# Altium project RFSoC-AMC.PrjPCB (part 15 of 22)

## Sheet SoC_FPGA_HD_84_87.SchDoc: RFSoC AMC
size 420 x 297 mm; CompanyName: WUT; DrawnBy: T. Przywozki; Organization: WUT ISE; Address1: Warsaw University of Technology; Address2: Nowowiejska 15/19 00-665 Warsaw; Address3: Tomasz.Przywozki@pw.edu.pl; DocumentNumber: 5; Revision: 1; SheetNumber: 5; SheetTotal: 45; Project: RFSoC AMC; ModifiedBy: T. Przywozki; CreateDate: -; CheckedDate: -; DivGrp: ISE; Designer: T. Przywozki; ModifiedDate: -; ProjectName: ADC/DAC MEZZANINE
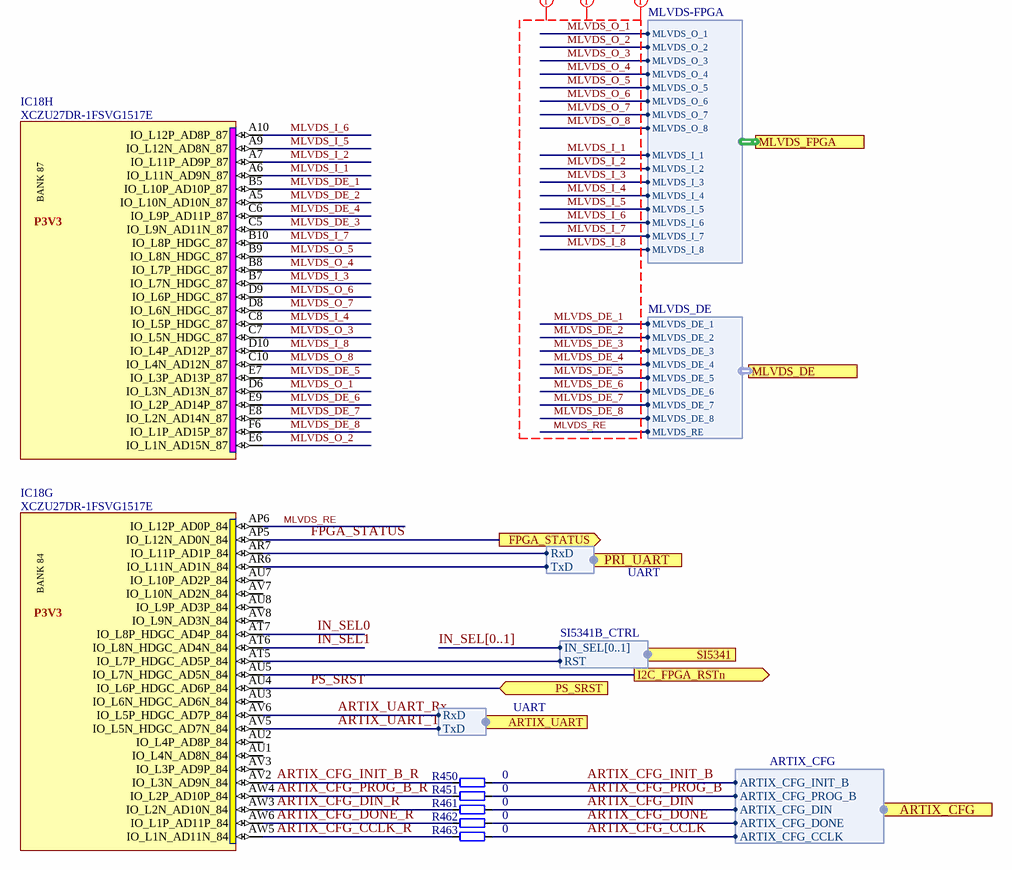
[diagram p30: SoC_FPGA_HD_84_87.SchDoc]

### Parts
IC18  XCZU27DR-1FSVG1517E  [XILINX_FSVG1517 (XCZU27DR)]  (parts G,H of 31)
R450  0  [RESC1005X40N]
R451  0  [RESC1005X40N]
R461  0  [RESC1005X40N]
R462  0  [RESC1005X40N]
R463  0  [RESC1005X40N]

### Ports
ARTIX_CFG (harness ARTIX_CFG), ARTIX_UART (harness UART), FPGA_STATUS (out), I2C_FPGA_RSTn (out), MLVDS_DE (harness MLVDS_DE), MLVDS_FPGA (harness MLVDS-FPGA), PRI_UART (harness UART), PS_SRST (in), SI5341 (harness SI5341B_CTRL)

### Harnesses
ARTIX_CFG: ARTIX_CFG_DIN, ARTIX_CFG_CCLK, ARTIX_CFG_PROG_B, ARTIX_CFG_DONE, ARTIX_CFG_INIT_B
UART: RxD, TxD
SI5341B_CTRL: IN_SEL[0..1], RST
MLVDS-FPGA: MLVDS_O_1, MLVDS_O_2, MLVDS_O_3, MLVDS_O_4, MLVDS_O_5, MLVDS_O_6, MLVDS_O_7, MLVDS_O_8, MLVDS_I_1, MLVDS_I_2, MLVDS_I_3, MLVDS_I_4, MLVDS_I_5, MLVDS_I_6, MLVDS_I_7, MLVDS_I_8
MLVDS_DE: MLVDS_DE_1, MLVDS_DE_2, MLVDS_DE_3, MLVDS_DE_4, MLVDS_DE_5, MLVDS_DE_6, MLVDS_DE_7, MLVDS_DE_8, MLVDS_RE

### Nets
ARTIX_CFG_CCLK: R463.2 ; port ARTIX_CFG.ARTIX_CFG_CCLK  [project net ARTIX_CFG.ARTIX_CFG_CCLK]
ARTIX_CFG_CCLK_R: IC18.AW5(IO_L1N_AD11N_84) R463.1
ARTIX_CFG_DIN: R461.2 ; port ARTIX_CFG.ARTIX_CFG_DIN  [project net ARTIX_CFG.ARTIX_CFG_DIN]
ARTIX_CFG_DIN_R: IC18.AW3(IO_L2N_AD10N_84) R461.1
ARTIX_CFG_DONE: R462.2 ; port ARTIX_CFG.ARTIX_CFG_DONE  [project net ARTIX_CFG.ARTIX_CFG_DONE]
ARTIX_CFG_DONE_R: IC18.AW6(IO_L1P_AD11P_84) R462.1
ARTIX_CFG_INIT_B: R450.2 ; port ARTIX_CFG.ARTIX_CFG_INIT_B  [project net ARTIX_CFG.ARTIX_CFG_INIT_B]
ARTIX_CFG_INIT_B_R: IC18.AV2(IO_L3N_AD9N_84) R450.1
ARTIX_CFG_PROG_B: R451.2 ; port ARTIX_CFG.ARTIX_CFG_PROG_B  [project net ARTIX_CFG.ARTIX_CFG_PROG_B]
ARTIX_CFG_PROG_B_R: IC18.AW4(IO_L2P_AD10P_84) R451.1
ARTIX_UART_Rx: IC18.AV6(IO_L5P_HDGC_AD7P_84) ; port ARTIX_UART.RxD
ARTIX_UART_Tx: IC18.AV5(IO_L5N_HDGC_AD7N_84) ; port ARTIX_UART.TxD
FPGA_STATUS: IC18.AP5(IO_L12N_AD0N_84) ; port FPGA_STATUS
IN_SEL0: IC18.AT7(IO_L8P_HDGC_AD4P_84)
IN_SEL1: IC18.AT6(IO_L8N_HDGC_AD4N_84)
MLVDS_DE_1: IC18.B5(IO_L10P_AD10P_87) ; port MLVDS_DE.MLVDS_DE_1
MLVDS_DE_2: IC18.A5(IO_L10N_AD10N_87) ; port MLVDS_DE.MLVDS_DE_2
MLVDS_DE_3: IC18.C5(IO_L9N_AD11N_87) ; port MLVDS_DE.MLVDS_DE_3
MLVDS_DE_4: IC18.C6(IO_L9P_AD11P_87) ; port MLVDS_DE.MLVDS_DE_4
MLVDS_DE_5: IC18.E7(IO_L3P_AD13P_87) ; port MLVDS_DE.MLVDS_DE_5
MLVDS_DE_6: IC18.E9(IO_L2P_AD14P_87) ; port MLVDS_DE.MLVDS_DE_6
MLVDS_DE_7: IC18.E8(IO_L2N_AD14N_87) ; port MLVDS_DE.MLVDS_DE_7
MLVDS_DE_8: IC18.F6(IO_L1P_AD15P_87) ; port MLVDS_DE.MLVDS_DE_8
MLVDS_I_1: IC18.A6(IO_L11N_AD9N_87) ; port MLVDS_FPGA.MLVDS_I_1
MLVDS_I_2: IC18.A7(IO_L11P_AD9P_87) ; port MLVDS_FPGA.MLVDS_I_2
MLVDS_I_3: IC18.B7(IO_L7N_HDGC_87) ; port MLVDS_FPGA.MLVDS_I_3
MLVDS_I_4: IC18.C8(IO_L5P_HDGC_87) ; port MLVDS_FPGA.MLVDS_I_4
MLVDS_I_5: IC18.A9(IO_L12N_AD8N_87) ; port MLVDS_FPGA.MLVDS_I_5
MLVDS_I_6: IC18.A10(IO_L12P_AD8P_87) ; port MLVDS_FPGA.MLVDS_I_6
MLVDS_I_7: IC18.B10(IO_L8P_HDGC_87) ; port MLVDS_FPGA.MLVDS_I_7
MLVDS_I_8: IC18.D10(IO_L4P_AD12P_87) ; port MLVDS_FPGA.MLVDS_I_8
MLVDS_O_1: IC18.D6(IO_L3N_AD13N_87) ; port MLVDS_FPGA.MLVDS_O_1
MLVDS_O_2: IC18.E6(IO_L1N_AD15N_87) ; port MLVDS_FPGA.MLVDS_O_2
MLVDS_O_3: IC18.C7(IO_L5N_HDGC_87) ; port MLVDS_FPGA.MLVDS_O_3
MLVDS_O_4: IC18.B8(IO_L7P_HDGC_87) ; port MLVDS_FPGA.MLVDS_O_4
MLVDS_O_5: IC18.B9(IO_L8N_HDGC_87) ; port MLVDS_FPGA.MLVDS_O_5
MLVDS_O_6: IC18.D9(IO_L6P_HDGC_87) ; port MLVDS_FPGA.MLVDS_O_6
MLVDS_O_7: IC18.D8(IO_L6N_HDGC_87) ; port MLVDS_FPGA.MLVDS_O_7
MLVDS_O_8: IC18.C10(IO_L4N_AD12N_87) ; port MLVDS_FPGA.MLVDS_O_8
MLVDS_RE: IC18.AP6(IO_L12P_AD0P_84) ; port MLVDS_DE.MLVDS_RE
PS_SRST: IC18.AU4(IO_L6P_HDGC_AD6P_84) ; port PS_SRST
NetIC18_AR6: IC18.AR6(IO_L11N_AD1N_84) ; port PRI_UART.TxD
NetIC18_AR7: IC18.AR7(IO_L11P_AD1P_84) ; port PRI_UART.RxD
NetIC18_AT5: IC18.AT5(IO_L7P_HDGC_AD5P_84) ; port SI5341.RST
NetIC18_AU5: IC18.AU5(IO_L7N_HDGC_AD5N_84) ; port I2C_FPGA_RSTn

Not connected (* = marked no-connect by the designer): IC18 AU1(IO_L4N_AD8N_84) AU2(IO_L4P_AD8P_84) AU3(IO_L6N_HDGC_AD6N_84) AU7(IO_L10P_AD2P_84) AU8(IO_L9P_AD3P_84) AV3(IO_L3P_AD9P_84) AV7(IO_L10N_AD2N_84) AV8(IO_L9N_AD3N_84)

### Buses and harness runs
bus IN_SEL[0..1]

### Layout directives
net class MLVDS_F: MLVDS_DE_1, MLVDS_DE_2, MLVDS_DE_3, MLVDS_DE_4, MLVDS_DE_5, MLVDS_DE_6, MLVDS_DE_7, MLVDS_DE_8, MLVDS_I_1, MLVDS_I_2, MLVDS_I_3, MLVDS_I_4, MLVDS_I_5, MLVDS_I_6, MLVDS_I_7, MLVDS_I_8, MLVDS_O_1, MLVDS_O_2, MLVDS_O_3, MLVDS_O_4, MLVDS_O_5, MLVDS_O_6, MLVDS_O_7, MLVDS_O_8, MLVDS_RE
net class SE50: MLVDS_DE_1, MLVDS_DE_2, MLVDS_DE_3, MLVDS_DE_4, MLVDS_DE_5, MLVDS_DE_6, MLVDS_DE_7, MLVDS_DE_8, MLVDS_I_1, MLVDS_I_2, MLVDS_I_3, MLVDS_I_4, MLVDS_I_5, MLVDS_I_6, MLVDS_I_7, MLVDS_I_8, MLVDS_O_1, MLVDS_O_2, MLVDS_O_3, MLVDS_O_4, MLVDS_O_5, MLVDS_O_6, MLVDS_O_7, MLVDS_O_8, MLVDS_RE
net class SE_SIG: MLVDS_DE_1, MLVDS_DE_2, MLVDS_DE_3, MLVDS_DE_4, MLVDS_DE_5, MLVDS_DE_6, MLVDS_DE_7, MLVDS_DE_8, MLVDS_I_1, MLVDS_I_2, MLVDS_I_3, MLVDS_I_4, MLVDS_I_5, MLVDS_I_6, MLVDS_I_7, MLVDS_I_8, MLVDS_O_1, MLVDS_O_2, MLVDS_O_3, MLVDS_O_4, MLVDS_O_5, MLVDS_O_6, MLVDS_O_7, MLVDS_O_8, MLVDS_RE

### Notes on the sheet
- P3V3
- Project/Equipment
- Document
- Designer
- Drawn by
- Check.by
- Copyright WUT ISE 2021
  This documentation describes Open Hardware and is licensed under CERN OHL v.1.1. You may redistribute and modify this documentaction under the terms of the CERN OHL v1.1.
  (http://ohwr.org/CERNOHL). This documentation is dristributed WITHOUT ANY EXPRESS OR IMPLIED WARRANTY, INCLUDING OF MERCHANTABLITY, SATISFACTORY QUALITY AND FITNESS FOR A PARTICULAR PURPOSE. Please see the CERN OHL v.1.1 for applicable conditions
- File
- Last Mod.
- Print Date
- Sheet
- Size
- A3
- of
- Rev
- Contact:
- (in symbol XCZU27DR-1FSVG1517E, part G) BANK 84
- (in symbol XCZU27DR-1FSVG1517E, part H) BANK 87

### Library data of the parts
IC18 = XCZU27DR-1FSVG1517E: Zynq UltraScale+ RFSoC, Quad-Core ARM® Cortex™-A53 MPCore™ up to 1.5GHz, 214 PS I/O, 299 HP I/O, 48 HD I/O, 1517-Pin BGA; Manufacturer: XILINX; PressFit: No; Bonding: No; Part Number: XCZU27DR-1FSVG1517E; Component Kind: Standard; Component Type: Standard; Device: XCZU27DR-1FSVG1517E; PackageDescription: BGA, 1.00mm Pitch, Square; 1517 Pin, 39 Columns X 39 Rows, 40.00mm X 40.00mm X 4.01mm H; Part Description: Zynq UltraScale+ RFSoC, Quad-Core ARM® Cortex™-A53 MPCore™ up to 1.5GHz, 214 PS I/O, 299 HP I/O, 48 HD I/O, 1517-Pin BGA; Manufacturer Part Number: XCZU27DR-1FSVG1517E; Pin Count: 1517; Case: BGA1517; Mounted: Yes; Socket: No; SMD: Yes; Sense: No; ComponentHeight: 4.01mm; HelpURL: \\cern.ch\dfs\Applications\Altium\Datasheets\XCZU27DR-1FSVG1517E.pdf; ComponentLink1URL: \\cern.ch\dfs\Applications\Altium\Datasheets\XCZU27DR-1FSVG1517E_Package-Pinout.pdf; ComponentLink1Description: Package/Pinout; ComponentLink2URL: \\cern.ch\dfs\Applications\Altium\Datasheets\XCZU27DR-1FSVG1517E_Pinout.pdf; ComponentLink2Description: Pinout; Author: CERN DEM MR; CreateDate: 02/05/2018; LatestRevisionDate: 02/05/2018
R450 R451 R461-R463 = R0402_0R_JUMPER: Resistor; Manufacturer: GENERIC; Part Description: 1A (0.05R Max DC Resistance) Zero Ohm Jumper; Manufacturer1 Part Number: 232270591001L; PressFit: No; Manufacturer Part Number: R0402_0R_JUMPER; Part Number: R0402_0R_JUMPER; Value: 0; Component Kind: Standard; Component Type: Standard; Pin Count: 2; Status: Not Recommended; Case: 0402; Mounted: Yes; Sense: No; Socket: No; SMD: Yes; Manufacturer1 Example: YAGEO PHYCOMP; Manufacturer1 ComponentHeight: 0.4mm; HelpURL: \\cern.ch\dfs\Applications\Altium\Datasheets\R0402_Phycomp_RC0402.pdf; Author: CERN DEM JLC; CreateDate: 03.12.2007; LatestRevisionDate: 17.10.2012

## Sheet SoC_FPGA_Config_0.SchDoc: RFSoC AMC
size 420 x 297 mm; CompanyName: WUT; DrawnBy: T. Przywozki; Organization: WUT ISE; Address1: Warsaw University of Technology; Address2: Nowowiejska 15/19 00-665 Warsaw; Address3: Tomasz.Przywozki@pw.edu.pl; DocumentNumber: 2; Revision: 1; SheetNumber: 2; SheetTotal: 45; Project: RFSoC AMC; ModifiedBy: T. Przywozki; CreateDate: -; CheckedDate: -; DivGrp: ISE; Designer: T. Przywozki; ModifiedDate: -; ProjectName: ADC/DAC MEZZANINE
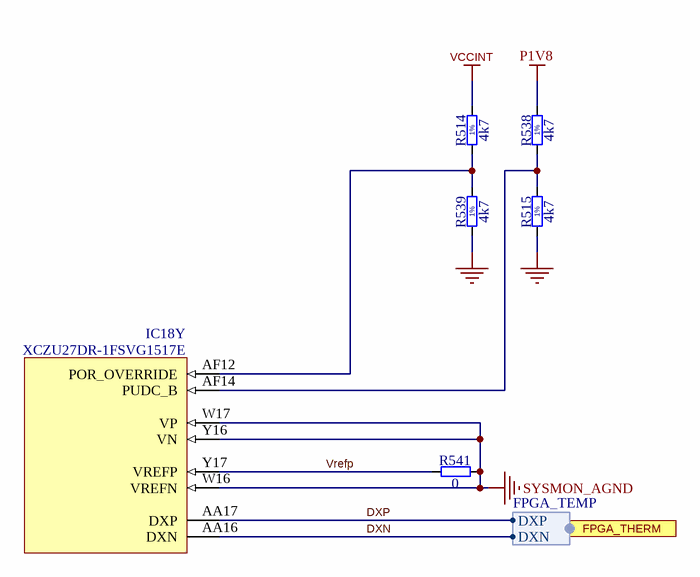
[diagram p31: SoC_FPGA_Config_0.SchDoc]

### Parts
(Parts that share a designator on the sheet are numbered #1, #2 ... from top to bottom, then left to right.)
IC18  XCZU27DR-1FSVG1517E  [XILINX_FSVG1517 (XCZU27DR)]  (part Y of 31)
R514#2  4k7  [RESC1005X40N]
R515#2  4k7  [RESC1005X40N]
R538  4k7  [RESC1005X40N]
R539  4k7  [RESC1005X40N]
R541  0  [RESC1005X40N]

### Ports
FPGA_THERM (harness FPGA_TEMP)

### Harnesses
FPGA_TEMP: DXP, DXN

### Nets
GND: R515#2.1 R539.1
P1V8: R538.2
SYSMON_AGND: IC18.W16(VREFN) IC18.W17(VP) IC18.Y16(VN) R541.2
VCCINT: R514#2.2
DXN: IC18.AA16(DXN) ; port FPGA_THERM.DXN
DXP: IC18.AA17(DXP) ; port FPGA_THERM.DXP
Vrefp: IC18.Y17(VREFP) R541.1
NetIC18_AF12: IC18.AF12(POR_OVERRIDE) R514#2.1 R539.2
NetIC18_AF14: IC18.AF14(PUDC_B) R515#2.2 R538.1

### Notes on the sheet
- Project/Equipment
- Document
- Designer
- Drawn by
- Check.by
- Copyright WUT ISE 2021
  This documentation describes Open Hardware and is licensed under CERN OHL v.1.1. You may redistribute and modify this documentaction under the terms of the CERN OHL v1.1.
  (http://ohwr.org/CERNOHL). This documentation is dristributed WITHOUT ANY EXPRESS OR IMPLIED WARRANTY, INCLUDING OF MERCHANTABLITY, SATISFACTORY QUALITY AND FITNESS FOR A PARTICULAR PURPOSE. Please see the CERN OHL v.1.1 for applicable conditions
- File
- Last Mod.
- Print Date
- Sheet
- Size
- A3
- of
- Rev
- Contact:
- (in symbol R0402_4K7_1%_0.0625W_100PPM) 1%

### Library data of the parts
IC18 = XCZU27DR-1FSVG1517E: as IC18 on sheet SoC_FPGA_HD_84_87; Part Number: XCZU27DR-1FSVG1517E; Component Kind: Standard; Component Type: Standard; Device: XCZU27DR-1FSVG1517E; PackageDescription: BGA, 1.00mm Pitch, Square; 1517 Pin, 39 Columns X 39 Rows, 40.00mm X 40.00mm X 4.01mm H; Part Description: Zynq UltraScale+ RFSoC, Quad-Core ARM® Cortex™-A53 MPCore™ up to 1.5GHz, 214 PS I/O, 299 HP I/O, 48 HD I/O, 1517-Pin BGA; Manufacturer Part Number: XCZU27DR-1FSVG1517E; Pin Count: 1517; Case: BGA1517; Mounted: Yes; Socket: No; SMD: Yes; Sense: No; ComponentHeight: 4.01mm; HelpURL: \\cern.ch\dfs\Applications\Altium\Datasheets\XCZU27DR-1FSVG1517E.pdf; ComponentLink1URL: \\cern.ch\dfs\Applications\Altium\Datasheets\XCZU27DR-1FSVG1517E_Package-Pinout.pdf; ComponentLink1Description: Package/Pinout; ComponentLink2URL: \\cern.ch\dfs\Applications\Altium\Datasheets\XCZU27DR-1FSVG1517E_Pinout.pdf; ComponentLink2Description: Pinout; Author: CERN DEM MR; CreateDate: 02/05/2018; LatestRevisionDate: 02/05/2018
R514#2 R515#2 R538 R539 = R0402_4K7_1%_0.0625W_100PPM: Resistor - 1%; Part Description: General Purpose Thick Film Chip Resistor; Manufacturer: GENERIC; Manufacturer1 Part Number: 232270674702L; TC: ±100ppm/°C; PressFit: No; Part Number: R0402_4K7_1%_0.0625W_100PPM; Component Kind: Standard; Component Type: Standard; Pin Count: 2; Value: 4k7; Status: Not Recommended; Power: 0.0625W; Tolerance: ±1%; Manufacturer Part Number: R0402_4K7_1%_0.0625W_100PPM; Case: 0402; Mounted: Yes; Sense: No; Socket: No; SMD: Yes; Manufacturer1 Example: YAGEO PHYCOMP; Manufacturer1 ComponentHeight: 0.4mm; HelpURL: \\cern.ch\dfs\Applications\Altium\Datasheets\R0402_Phycomp_RC0402.pdf; Author: CERN DEM JLC; CreateDate: 03.12.2007; LatestRevisionDate: 17.10.2012
R541 = R0402_0R_JUMPER: as R450 on sheet SoC_FPGA_HD_84_87; Manufacturer Part Number: R0402_0R_JUMPER; Part Number: R0402_0R_JUMPER; Value: 0; Component Kind: Standard; Component Type: Standard; Pin Count: 2; Status: Not Recommended; Case: 0402; Mounted: Yes; Sense: No; Socket: No; SMD: Yes; Manufacturer1 Example: YAGEO PHYCOMP; Manufacturer1 ComponentHeight: 0.4mm; HelpURL: \\cern.ch\dfs\Applications\Altium\Datasheets\R0402_Phycomp_RC0402.pdf; Author: CERN DEM JLC; CreateDate: 03.12.2007; LatestRevisionDate: 17.10.2012

## Sheet SoC_Supply.SchDoc: RFSoC AMC
size 420 x 297 mm; CompanyName: WUT; DrawnBy: T. Przywozki; Organization: WUT ISE; Address1: Warsaw University of Technology; Address2: Nowowiejska 15/19 00-665 Warsaw; Address3: Tomasz.Przywozki@pw.edu.pl; DocumentNumber: 12; Revision: 1; SheetNumber: 12; SheetTotal: 45; Project: RFSoC AMC; ModifiedBy: T. Przywozki; CreateDate: -; CheckedDate: -; DivGrp: ISE; Designer: T. Przywozki; ModifiedDate: -; ProjectName: ADC/DAC MEZZANINE
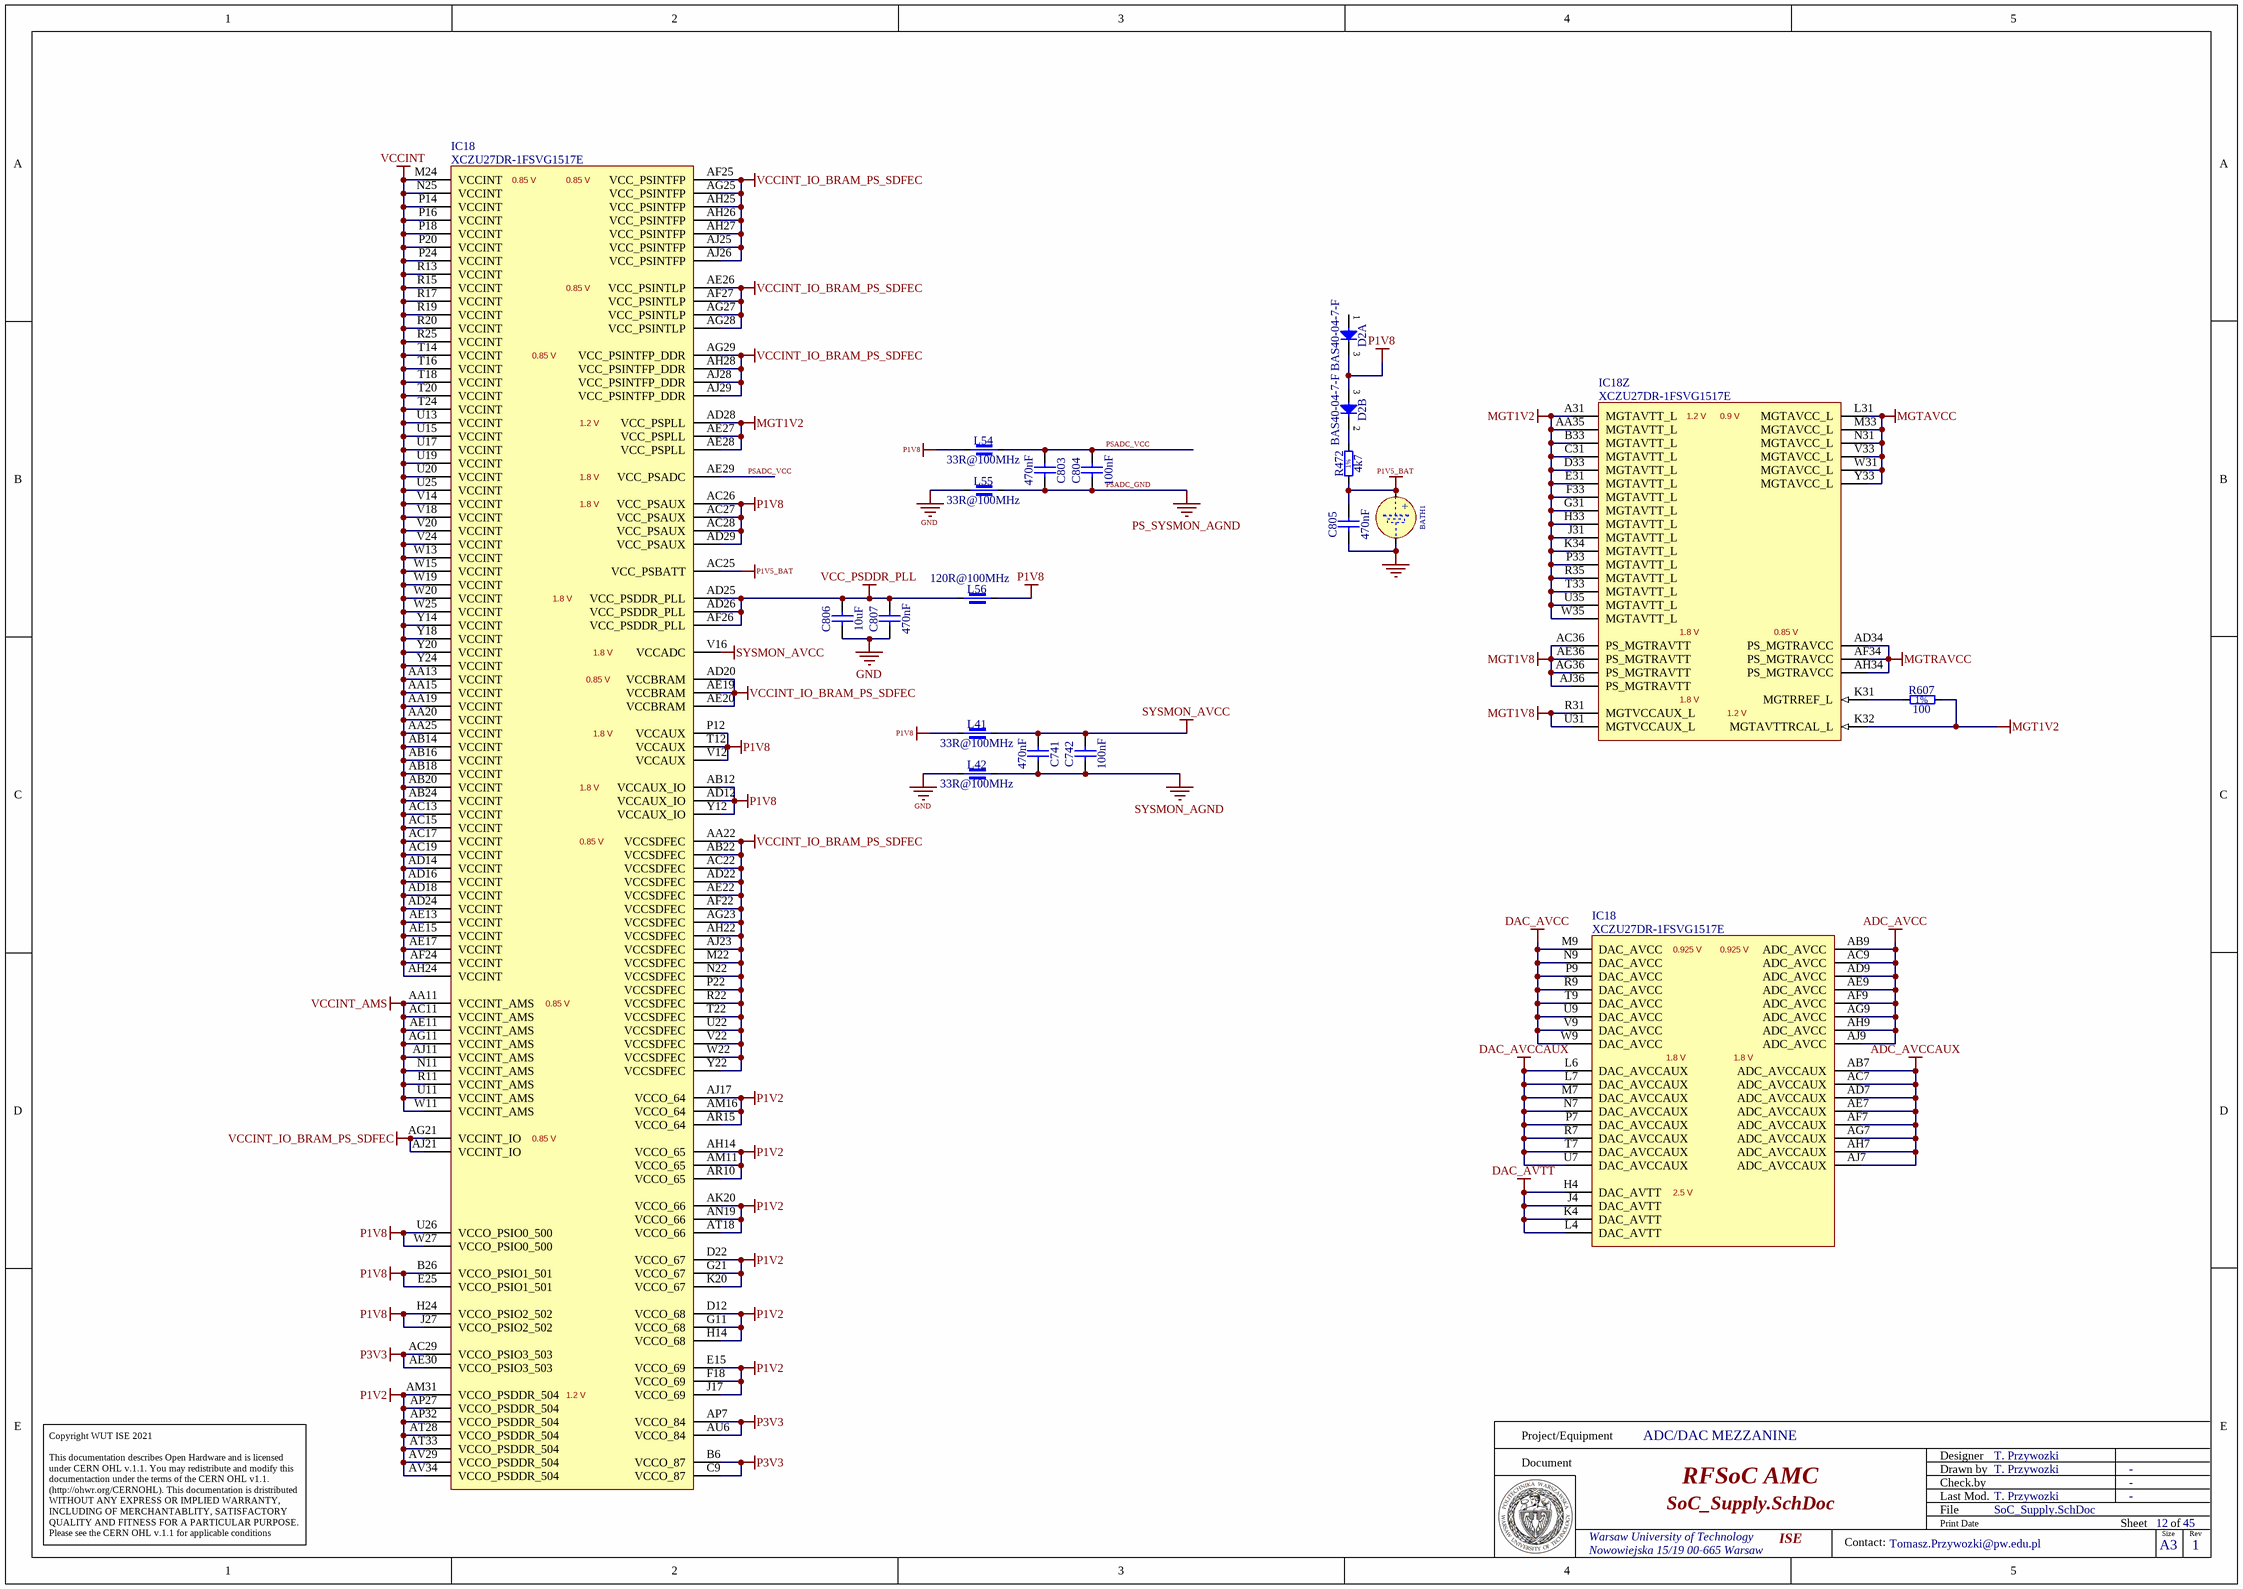
[diagram p32: SoC_Supply.SchDoc]

### Parts
BATH1  (no value)  [BATH_KEYSTONE_2998]
C741  470nF  [CAPC0603X33N]
C742  100nF  [CAPC1005X55N]
C803  470nF  [CAPC0603X33N]
C804  100nF  [CAPC1005X55N]
C805  470nF  [CAPC0603X33N]
C806  10uF  [CAPC1608X80N]
C807  470nF  [CAPC1005X55N]
D2  BAS40-04-7-F  [SOT95P240X110-3N]  (parts A,B of 2)
IC18  XCZU27DR-1FSVG1517E  [XILINX_FSVG1517 (XCZU27DR)]  (parts Z,27,28 of 31)
L41  33R@100MHz  [INDC1005X55N]
L42  33R@100MHz  [INDC1005X55N]
L54  33R@100MHz  [INDC1005X55N]
L55  33R@100MHz  [INDC1005X55N]
L56  120R@100MHz  [INDC1608X95N]
R472  4k7  [RESC1005X40N]
R607  100  [RESC1005X40N]

### Nets
ADC_AVCC: IC18.AB9(ADC_AVCC) IC18.AC9(ADC_AVCC) IC18.AD9(ADC_AVCC) IC18.AE9(ADC_AVCC) IC18.AF9(ADC_AVCC) IC18.AG9(ADC_AVCC) IC18.AH9(ADC_AVCC) IC18.AJ9(ADC_AVCC)
ADC_AVCCAUX: IC18.AB7(ADC_AVCCAUX) IC18.AC7(ADC_AVCCAUX) IC18.AD7(ADC_AVCCAUX) IC18.AE7(ADC_AVCCAUX) IC18.AF7(ADC_AVCCAUX) IC18.AG7(ADC_AVCCAUX) IC18.AH7(ADC_AVCCAUX) IC18.AJ7(ADC_AVCCAUX)
DAC_AVCC: IC18.M9(DAC_AVCC) IC18.N9(DAC_AVCC) IC18.P9(DAC_AVCC) IC18.R9(DAC_AVCC) IC18.T9(DAC_AVCC) IC18.U9(DAC_AVCC) IC18.V9(DAC_AVCC) IC18.W9(DAC_AVCC)
DAC_AVCCAUX: IC18.L6(DAC_AVCCAUX) IC18.L7(DAC_AVCCAUX) IC18.M7(DAC_AVCCAUX) IC18.N7(DAC_AVCCAUX) IC18.P7(DAC_AVCCAUX) IC18.R7(DAC_AVCCAUX) IC18.T7(DAC_AVCCAUX) IC18.U7(DAC_AVCCAUX)
DAC_AVTT: IC18.H4(DAC_AVTT) IC18.J4(DAC_AVTT) IC18.K4(DAC_AVTT) IC18.L4(DAC_AVTT)
GND: BATH1.2(MINUS) C805.1 C806.1 C807.1 L42.1 L55.1
MGT1V2: IC18.A31(MGTAVTT_L) IC18.AA35(MGTAVTT_L) IC18.AD28(VCC_PSPLL) IC18.AE27(VCC_PSPLL) IC18.AE28(VCC_PSPLL) IC18.B33(MGTAVTT_L) IC18.C31(MGTAVTT_L) IC18.D33(MGTAVTT_L) IC18.E31(MGTAVTT_L) IC18.F33(MGTAVTT_L) IC18.G31(MGTAVTT_L) IC18.H33(MGTAVTT_L) IC18.J31(MGTAVTT_L) IC18.K32(MGTAVTTRCAL_L) IC18.K34(MGTAVTT_L) IC18.P33(MGTAVTT_L) IC18.R35(MGTAVTT_L) IC18.T33(MGTAVTT_L) IC18.U35(MGTAVTT_L) IC18.W35(MGTAVTT_L) R607.2
MGT1V8: IC18.AC36(PS_MGTRAVTT) IC18.AE36(PS_MGTRAVTT) IC18.AG36(PS_MGTRAVTT) IC18.AJ36(PS_MGTRAVTT) IC18.R31(MGTVCCAUX_L) IC18.U31(MGTVCCAUX_L)
MGTAVCC: IC18.L31(MGTAVCC_L) IC18.M33(MGTAVCC_L) IC18.N31(MGTAVCC_L) IC18.V33(MGTAVCC_L) IC18.W31(MGTAVCC_L) IC18.Y33(MGTAVCC_L)
MGTRAVCC: IC18.AD34(PS_MGTRAVCC) IC18.AF34(PS_MGTRAVCC) IC18.AH34(PS_MGTRAVCC)
P1V2: IC18.AH14(VCCO_65) IC18.AJ17(VCCO_64) IC18.AK20(VCCO_66) IC18.AM11(VCCO_65) IC18.AM16(VCCO_64) IC18.AM31(VCCO_PSDDR_504) IC18.AN19(VCCO_66) IC18.AP27(VCCO_PSDDR_504) IC18.AP32(VCCO_PSDDR_504) IC18.AR10(VCCO_65) IC18.AR15(VCCO_64) IC18.AT18(VCCO_66) IC18.AT28(VCCO_PSDDR_504) IC18.AT33(VCCO_PSDDR_504) IC18.AV29(VCCO_PSDDR_504) IC18.AV34(VCCO_PSDDR_504) IC18.D12(VCCO_68) IC18.D22(VCCO_67) IC18.E15(VCCO_69) IC18.F18(VCCO_69) IC18.G11(VCCO_68) IC18.G21(VCCO_67) IC18.H14(VCCO_68) IC18.J17(VCCO_69) IC18.K20(VCCO_67)
P1V5_BAT: BATH1.1(PLUS) C805.2 IC18.AC25(VCC_PSBATT) R472.1
P1V8: D2.3(COMAC) IC18.AB12(VCCAUX_IO) IC18.AC26(VCC_PSAUX) IC18.AC27(VCC_PSAUX) IC18.AC28(VCC_PSAUX) IC18.AD12(VCCAUX_IO) IC18.AD29(VCC_PSAUX) IC18.B26(VCCO_PSIO1_501) IC18.E25(VCCO_PSIO1_501) IC18.H24(VCCO_PSIO2_502) IC18.J27(VCCO_PSIO2_502) IC18.P12(VCCAUX) IC18.T12(VCCAUX) IC18.U26(VCCO_PSIO0_500) IC18.V12(VCCAUX) IC18.W27(VCCO_PSIO0_500) IC18.Y12(VCCAUX_IO) L41.1 L54.1 L56.1
P3V3: IC18.AC29(VCCO_PSIO3_503) IC18.AE30(VCCO_PSIO3_503) IC18.AP7(VCCO_84) IC18.AU6(VCCO_84) IC18.B6(VCCO_87) IC18.C9(VCCO_87)
PSADC_GND: C803.1 C804.1 L55.2  [also labelled PS_SYSMON_AGND]
SYSMON_AGND: C741.1 C742.1 L42.2
SYSMON_AVCC: C741.2 C742.2 IC18.V16(VCCADC) L41.2
VCC_PSDDR_PLL: C806.2 C807.2 IC18.AD25(VCC_PSDDR_PLL) IC18.AD26(VCC_PSDDR_PLL) IC18.AF26(VCC_PSDDR_PLL) L56.2
VCCINT: IC18.AA13(VCCINT) IC18.AA15(VCCINT) IC18.AA19(VCCINT) IC18.AA20(VCCINT) IC18.AA25(VCCINT) IC18.AB14(VCCINT) IC18.AB16(VCCINT) IC18.AB18(VCCINT) IC18.AB20(VCCINT) IC18.AB24(VCCINT) IC18.AC13(VCCINT) IC18.AC15(VCCINT) IC18.AC17(VCCINT) IC18.AC19(VCCINT) IC18.AD14(VCCINT) IC18.AD16(VCCINT) IC18.AD18(VCCINT) IC18.AD24(VCCINT) IC18.AE13(VCCINT) IC18.AE15(VCCINT) IC18.AE17(VCCINT) IC18.AF24(VCCINT) IC18.AH24(VCCINT) IC18.M24(VCCINT) IC18.N25(VCCINT) IC18.P14(VCCINT) IC18.P16(VCCINT) IC18.P18(VCCINT) IC18.P20(VCCINT) IC18.P24(VCCINT) IC18.R13(VCCINT) IC18.R15(VCCINT) IC18.R17(VCCINT) IC18.R19(VCCINT) IC18.R20(VCCINT) IC18.R25(VCCINT) IC18.T14(VCCINT) IC18.T16(VCCINT) IC18.T18(VCCINT) IC18.T20(VCCINT) IC18.T24(VCCINT) IC18.U13(VCCINT) IC18.U15(VCCINT) IC18.U17(VCCINT) IC18.U19(VCCINT) IC18.U20(VCCINT) IC18.U25(VCCINT) IC18.V14(VCCINT) IC18.V18(VCCINT) IC18.V20(VCCINT) IC18.V24(VCCINT) IC18.W13(VCCINT) IC18.W15(VCCINT) IC18.W19(VCCINT) IC18.W20(VCCINT) IC18.W25(VCCINT) IC18.Y14(VCCINT) IC18.Y18(VCCINT) IC18.Y20(VCCINT) IC18.Y24(VCCINT)
VCCINT_AMS: IC18.AA11(VCCINT_AMS) IC18.AC11(VCCINT_AMS) IC18.AE11(VCCINT_AMS) IC18.AG11(VCCINT_AMS) IC18.AJ11(VCCINT_AMS) IC18.N11(VCCINT_AMS) IC18.R11(VCCINT_AMS) IC18.U11(VCCINT_AMS) IC18.W11(VCCINT_AMS)
VCCINT_IO_BRAM_PS_SDFEC: IC18.AA22(VCCSDFEC) IC18.AB22(VCCSDFEC) IC18.AC22(VCCSDFEC) IC18.AD20(VCCBRAM) IC18.AD22(VCCSDFEC) IC18.AE19(VCCBRAM) IC18.AE20(VCCBRAM) IC18.AE22(VCCSDFEC) IC18.AE26(VCC_PSINTLP) IC18.AF22(VCCSDFEC) IC18.AF25(VCC_PSINTFP) IC18.AF27(VCC_PSINTLP) IC18.AG21(VCCINT_IO) IC18.AG23(VCCSDFEC) IC18.AG25(VCC_PSINTFP) IC18.AG27(VCC_PSINTLP) IC18.AG28(VCC_PSINTLP) IC18.AG29(VCC_PSINTFP_DDR) IC18.AH22(VCCSDFEC) IC18.AH25(VCC_PSINTFP) IC18.AH26(VCC_PSINTFP) IC18.AH27(VCC_PSINTFP) IC18.AH28(VCC_PSINTFP_DDR) IC18.AJ21(VCCINT_IO) IC18.AJ23(VCCSDFEC) IC18.AJ25(VCC_PSINTFP) IC18.AJ26(VCC_PSINTFP) IC18.AJ28(VCC_PSINTFP_DDR) IC18.AJ29(VCC_PSINTFP_DDR) IC18.M22(VCCSDFEC) IC18.N22(VCCSDFEC) IC18.P22(VCCSDFEC) IC18.R22(VCCSDFEC) IC18.T22(VCCSDFEC) IC18.U22(VCCSDFEC) IC18.V22(VCCSDFEC) IC18.W22(VCCSDFEC) IC18.Y22(VCCSDFEC)
PSADC_VCC: C803.2 C804.2 IC18.AE29(VCC_PSADC) L54.2
NetD2_2: D2.2(C) R472.2
NetIC18_K31: IC18.K31(MGTRREF_L) R607.1

Not connected (* = marked no-connect by the designer): D2 1(A)

### Notes on the sheet
- (near IC18) 0.85 V
- (near IC18) 1.2 V
- (near IC18) 0.9 V
- (near IC18) 1.8 V
- (near IC18) 0.925 V
- (near IC18) 2.5 V
- Project/Equipment
- Document
- Designer
- Drawn by
- Check.by
- Copyright WUT ISE 2021
  This documentation describes Open Hardware and is licensed under CERN OHL v.1.1. You may redistribute and modify this documentaction under the terms of the CERN OHL v1.1.
  (http://ohwr.org/CERNOHL). This documentation is dristributed WITHOUT ANY EXPRESS OR IMPLIED WARRANTY, INCLUDING OF MERCHANTABLITY, SATISFACTORY QUALITY AND FITNESS FOR A PARTICULAR PURPOSE. Please see the CERN OHL v.1.1 for applicable conditions
- File
- Last Mod.
- Print Date
- Sheet
- Size
- A3
- of
- Rev
- Contact:
- (in symbol BATH_KEYSTONE_2998) +
- (in symbol R0402_4K7_1%_0.0625W_100PPM) 1%
- (in symbol R0402_100R_1%_0.1W_100PPM) 1%

### Library data of the parts
BATH1 = BATH_KEYSTONE_2998: Battery Holder whit 2 Pin; Part Description: SMD Battery Holder for MC621, V364, SC621, DR13H, DR77, V13AT, 377 Button Cells; Manufacturer Part Number: 2998; PressFit: No; Part Number: BATH_KEYSTONE_2998; Component Kind: Standard; Component Type: Standard; Pin Count: 3; PackageDescription: SMD Battery Holder for MC621, V364, SC621, DR13H, DR77, V13AT, 377 Button Cells; Family: Battery; Mounted: Yes; Socket: No; SMD: Yes; Sense: No; Manufacturer: KEYSTONE; ComponentHeight: 3.048mm; HelpURL: \\cern.ch\dfs\Applications\Altium\Datasheets\BATH_KEYSTONE_2998.pdf; Author: CERN DEM JLC; CreateDate: 03.07.2014; LatestRevisionDate: 07.06.2017
C741 C803 C805 = CC0201_470NF_4V_20%_X5R: Non-polarised capacitor; Manufacturer: GENERIC; Part Description: SMD Multilayer Chip Ceramic Capacitor; Manufacturer1 Part Number: AMK063BJ474MP-F; Tolerance: ±20%; Voltage: 4V; TC: X5R; Manufacturer Part Number: CC0201_470NF_4V_20%_X5R; Part Number: CC0201_470NF_4V_20%_X5R; Value: 470nF; Component Kind: Standard; Component Type: Standard; Pin Count: 2; Status: Not Recommended; Case: 0201; Mounted: Yes; Socket: No; SMD: Yes; Sense: No; Manufacturer1 Example: TAIYO YUDEN; Manufacturer1 ComponentHeight: 0.33mm; HelpURL: \\cern.ch\dfs\Applications\Altium\Datasheets\CC0201_X5R_TAIYO-YUDEN_STANDARD-CLASS2.pdf; Author: CERN DEM JLC; CreateDate: 27.05.2010; LatestRevisionDate: 27.05.2010
C742 C804 = CC0402_100NF_25V_10%_X7R_YUDEN_TMK105B7104KVHF: Non-polarised capacitor; Part Description: SMD Multilayer Chip Ceramic Capacitor (High Dielectric Type) for Automotive / Industrial Applications; Manufacturer: TAIYO YUDEN; Voltage: 25V; TC: X7R; Tolerance: ±10%; Part Number: CC0402_100NF_25V_10%_X7R_YUDEN_TMK105B7104KVHF; Component Kind: Standard; Component Type: Standard; Pin Count: 2; Value: 100nF; Status: Not Recommended; Manufacturer Part Number: TMK105B7104KVHF; Case: 0402; Mounted: Yes; Socket: No; SMD: Yes; Sense: No; ComponentHeight: 0.55mm; HelpURL: \\cern.ch\dfs\Applications\Altium\Datasheets\CC0402_TAIYO-YUDEN_TMK105B7104KVHF.pdf; Author: CERN DEM JLC; CreateDate: 10.05.2017; LatestRevisionDate: 10.05.2017
C806 = CC0603_10UF_10V_10%_X5R: Non-polarised capacitor; Part Description: SMD Multilayer Chip Ceramic Capacitor; Manufacturer: GENERIC; Manufacturer1 Part Number: GRM188R61A106KE69D; Voltage: 10V; TC: X5R; Tolerance: ±10%; Part Number: CC0603_10UF_10V_10%_X5R; Component Kind: Standard; Component Type: Standard; Pin Count: 2; Value: 10uF; Status: None; Manufacturer Part Number: CC0603_10UF_10V_10%_X5R; Case: 0603; Mounted: Yes; Socket: No; SMD: Yes; Sense: No; Manufacturer1 Example: MURATA; Manufacturer1 ComponentHeight: 0.8mm; HelpURL: \\cern.ch\dfs\Applications\Altium\Datasheets\CC0603_MURATA_GRM188R61A106KE69D.pdf; Author: CERN DEM JLC; CreateDate: 31.01.2017; LatestRevisionDate: 31.01.2017
C807 = CC0402_470NF_16V_10%_X5R: Non-polarised capacitor; Part Description: SMD Multilayer Chip Ceramic Capacitor; Manufacturer: GENERIC; Manufacturer1 Part Number: C1005X5R1C105KT; Voltage: 16V; TC: X5R; Tolerance: ±10%; Part Number: CC0402_470NF_16V_10%_X5R; Component Kind: Standard; Component Type: Standard; Pin Count: 2; Value: 470nF; Status: Preferred; Manufacturer Part Number: CC0402_470NF_16V_10%_X5R; Case: 0402; Mounted: Yes; Socket: No; SMD: Yes; Sense: No; Manufacturer1 Example: TDK; Manufacturer1 ComponentHeight: 0.55mm; HelpURL: \\cern.ch\dfs\Applications\Altium\Datasheets\CC0402_X5R_TDK_C.pdf; Author: CERN DEM JLC; CreateDate: 25.10.2012; LatestRevisionDate: 25.10.2012
D2 = BAS40-04-7-F: Serial Diode; Part Description: Dual Series Surface Mount Schottky Barrier Diodes; Manufacturer: DIODES INCORPORATED; Voltage: 40V; Power: 200mA; PressFit: No; Bonding: No; Part Number: BAS40-04-7-F; Component Kind: Standard; Component Type: Standard; Device: BAS40-04-7-F; PackageDescription: SOT, 0.95mm Pitch; 3 Pin, 1.30mm W X 2.90mm L X 1.10mm H, IPC Medium Density; Manufacturer Part Number: BAS40-04-7-F; Pin Count: 3; Case: SOT23-3; Mounted: Yes; Socket: No; SMD: Yes; Sense: No; ComponentHeight: 1.1mm; HelpURL: \\cern.ch\dfs\Applications\Altium\Datasheets\BAS40-04-7-F.pdf; Author: CERN DEM JLC; CreateDate: 07.07.2014; LatestRevisionDate: 07.07.2014
IC18 = XCZU27DR-1FSVG1517E: as IC18 on sheet SoC_FPGA_HD_84_87; Part Number: XCZU27DR-1FSVG1517E; Component Kind: Standard; Component Type: Standard; Device: XCZU27DR-1FSVG1517E; PackageDescription: BGA, 1.00mm Pitch, Square; 1517 Pin, 39 Columns X 39 Rows, 40.00mm X 40.00mm X 4.01mm H; Part Description: Zynq UltraScale+ RFSoC, Quad-Core ARM® Cortex™-A53 MPCore™ up to 1.5GHz, 214 PS I/O, 299 HP I/O, 48 HD I/O, 1517-Pin BGA; Manufacturer Part Number: XCZU27DR-1FSVG1517E; Pin Count: 1517; Case: BGA1517; Mounted: Yes; Socket: No; SMD: Yes; Sense: No; ComponentHeight: 4.01mm; HelpURL: \\cern.ch\dfs\Applications\Altium\Datasheets\XCZU27DR-1FSVG1517E.pdf; ComponentLink1URL: \\cern.ch\dfs\Applications\Altium\Datasheets\XCZU27DR-1FSVG1517E_Package-Pinout.pdf; ComponentLink1Description: Package/Pinout; ComponentLink2URL: \\cern.ch\dfs\Applications\Altium\Datasheets\XCZU27DR-1FSVG1517E_Pinout.pdf; ComponentLink2Description: Pinout; Author: CERN DEM MR; CreateDate: 02/05/2018; LatestRevisionDate: 02/05/2018
L41 L42 L54 L55 = IND0402_MURATA_BLM15PX330SN1D: Manufacturer: MURATA; Part Description: SMD EMIFIL Chip Ferrite Bead; Tolerance: ±25%; Power: 3A; Resistance: 0.022R; Manufacturer Part Number: BLM15PX330SN1D; Part Number: IND0402_MURATA_BLM15PX330SN1D; Value: 33R@100MHz; Component Kind: Standard; Component Type: Standard; Pin Count: 2; Status: None; Case: 0402; Mounted: Yes; Socket: No; SMD: Yes; Sense: No; ComponentHeight: 0.55mm; HelpURL: \\cern.ch\dfs\Applications\Altium\Datasheets\IND0402_MURATA_BLM15PX.pdf; Author: CERN DEM JMW; CreateDate: 19.02.2014; LatestRevisionDate: 25.10.2018
L56 = IND0603_MURATA_BLM18PG121SN1D: Manufacturer: MURATA; Part Description: SMD EMIFIL Chip Ferrite Bead; Power: 2A; Resistance: 0.05R; Manufacturer Part Number: BLM18PG121SN1D; Part Number: IND0603_MURATA_BLM18PG121SN1D; Value: 120R@100MHz; Component Kind: Standard; Component Type: Standard; Pin Count: 2; Status: None; Case: 0603; Mounted: Yes; Socket: No; SMD: Yes; Sense: No; ComponentHeight: 0.95mm; HelpURL: \\cern.ch\dfs\Applications\Altium\Datasheets\IND0603_MURATA_BLM18P.pdf; Author: CERN DEM BC; CreateDate: 27.07.2015; LatestRevisionDate: 25.10.2018
R472 = R0402_4K7_1%_0.0625W_100PPM: as R514#2 on sheet SoC_FPGA_Config_0; Part Number: R0402_4K7_1%_0.0625W_100PPM; Component Kind: Standard; Component Type: Standard; Pin Count: 2; Value: 4k7; Status: Not Recommended; Power: 0.0625W; Tolerance: ±1%; Manufacturer Part Number: R0402_4K7_1%_0.0625W_100PPM; Case: 0402; Mounted: Yes; Sense: No; Socket: No; SMD: Yes; Manufacturer1 Example: YAGEO PHYCOMP; Manufacturer1 ComponentHeight: 0.4mm; HelpURL: \\cern.ch\dfs\Applications\Altium\Datasheets\R0402_Phycomp_RC0402.pdf; Author: CERN DEM JLC; CreateDate: 03.12.2007; LatestRevisionDate: 17.10.2012
R607 = R0402_100R_1%_0.1W_100PPM: Resistor - 1%; Part Description: General Purpose Thick Film Chip Resistor; Manufacturer: GENERIC; Manufacturer Part Number: R0402_100R_1%_0.1W_100PPM_50V; Manufacturer1 Part Number: ERJ2RKF1000X; Power: 0.1W; TC: ±100ppm/°C; Voltage: 50V; PressFit: No; Part Number: R0402_100R_1%_0.1W_100PPM; Component Kind: Standard; Component Type: Standard; Pin Count: 2; Value: 100; Status: Not Recommended; Tolerance: ±1%; Case: 0402; Mounted: Yes; Sense: No; Socket: No; SMD: Yes; Manufacturer1 Example: PANASONIC; Manufacturer1 ComponentHeight: 0.4mm; HelpURL: \\cern.ch\dfs\Applications\Altium\Datasheets\R0402_PANASONIC_ERJ2RK.pdf; Author: CERN DEM JLC; CreateDate: 12.12.2013; LatestRevisionDate: 03.03.2015

## Sheet SoC_PS_504_DDR4.SchDoc: RFSoC AMC
size 420 x 297 mm; CompanyName: WUT; DrawnBy: T. Przywozki; Organization: WUT ISE; Address1: Warsaw University of Technology; Address2: Nowowiejska 15/19 00-665 Warsaw; Address3: Tomasz.Przywozki@pw.edu.pl; DocumentNumber: 10; Revision: 1; SheetNumber: 10; SheetTotal: 45; Project: RFSoC AMC; ModifiedBy: T. Przywozki; CreateDate: -; CheckedDate: -; DivGrp: ISE; Designer: T. Przywozki; ModifiedDate: -; ProjectName: ADC/DAC MEZZANINE
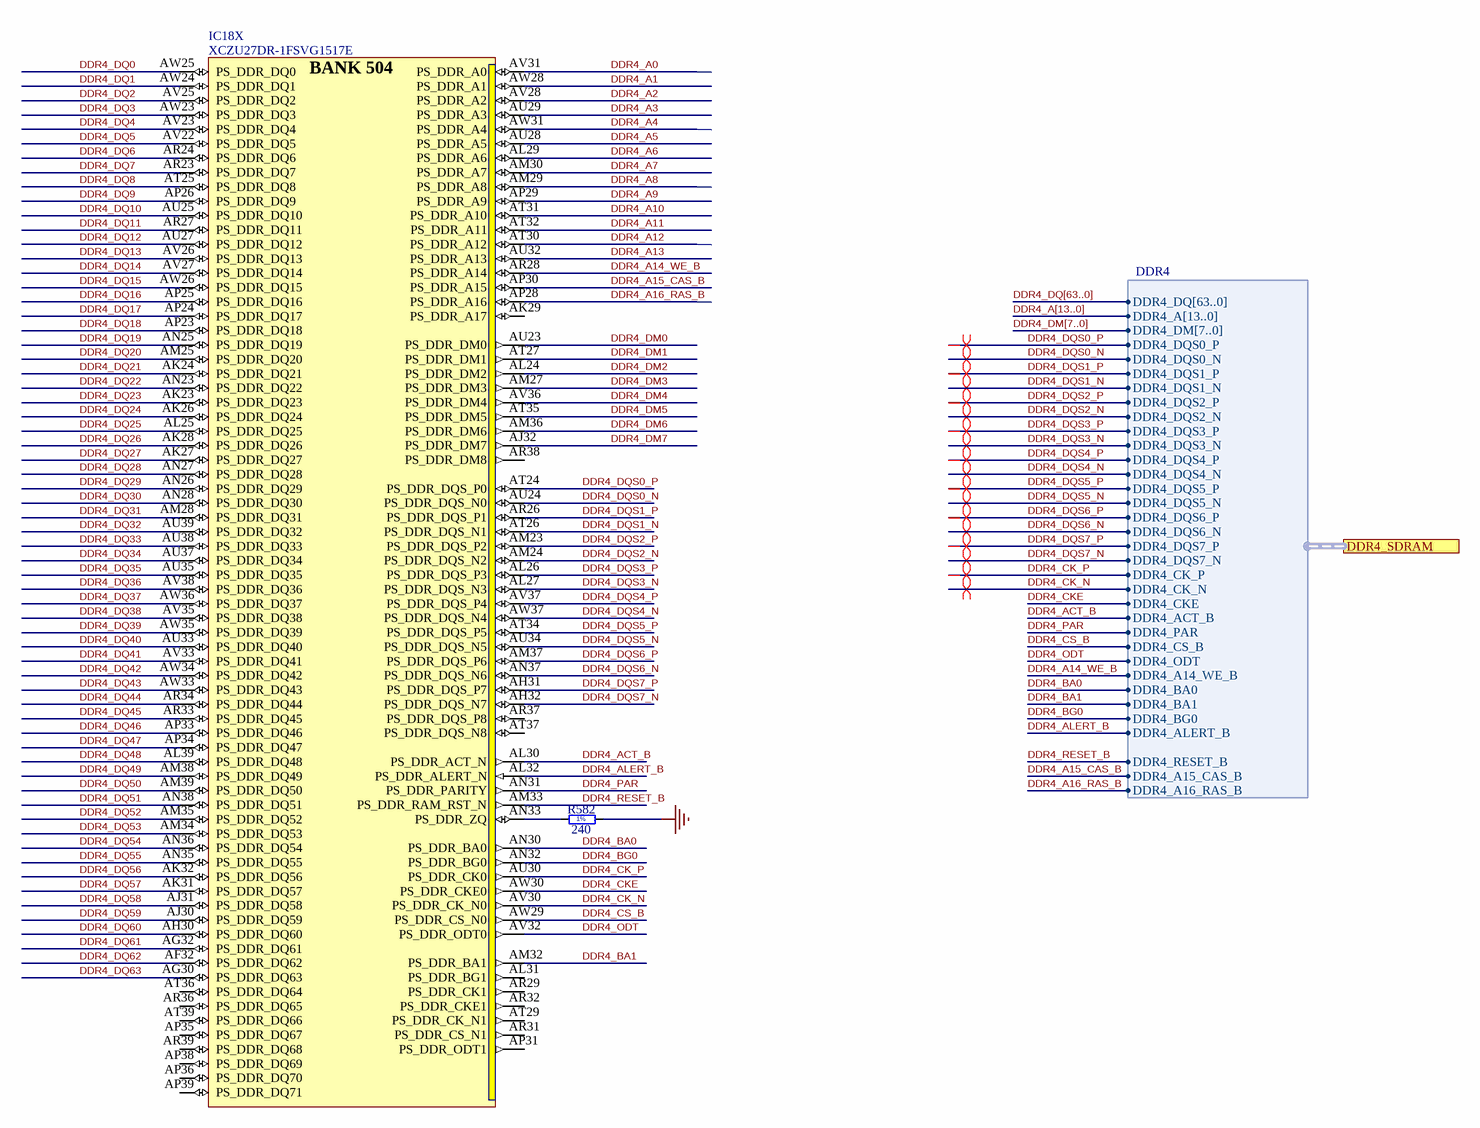
[diagram p33: SoC_PS_504_DDR4.SchDoc]

### Parts
IC18  XCZU27DR-1FSVG1517E  [XILINX_FSVG1517 (XCZU27DR)]  (part X of 31)
R582  240  [RESC1005X40N]

### Ports
DDR4_SDRAM (harness DDR4)

### Harnesses
DDR4: DDR4_DQ[63..0], DDR4_A[13..0], DDR4_DM[7..0], DDR4_DQS0_P, DDR4_DQS0_N, DDR4_DQS1_P, DDR4_DQS1_N, DDR4_DQS2_P, DDR4_DQS2_N, DDR4_DQS3_P, DDR4_DQS3_N, DDR4_DQS4_P, DDR4_DQS4_N, DDR4_DQS5_P, DDR4_DQS5_N, DDR4_DQS6_P, DDR4_DQS6_N, DDR4_DQS7_P, DDR4_DQS7_N, DDR4_CK_P, DDR4_CK_N, DDR4_CKE, DDR4_ACT_B, DDR4_PAR, DDR4_CS_B, DDR4_ODT, DDR4_A14_WE_B, DDR4_BA0, DDR4_BA1, DDR4_BG0, DDR4_ALERT_B, DDR4_RESET_B, DDR4_A15_CAS_B, DDR4_A16_RAS_B

### Nets
GND: R582.2
DDR4_A0: IC18.AV31(PS_DDR_A0)
DDR4_A1: IC18.AW28(PS_DDR_A1)
DDR4_A2: IC18.AV28(PS_DDR_A2)
DDR4_A3: IC18.AU29(PS_DDR_A3)
DDR4_A4: IC18.AW31(PS_DDR_A4)
DDR4_A5: IC18.AU28(PS_DDR_A5)
DDR4_A6: IC18.AL29(PS_DDR_A6)
DDR4_A7: IC18.AM30(PS_DDR_A7)
DDR4_A8: IC18.AM29(PS_DDR_A8)
DDR4_A9: IC18.AP29(PS_DDR_A9)
DDR4_A10: IC18.AT31(PS_DDR_A10)
DDR4_A11: IC18.AT32(PS_DDR_A11)
DDR4_A12: IC18.AT30(PS_DDR_A12)
DDR4_A13: IC18.AU32(PS_DDR_A13)
DDR4_A14_WE_B: IC18.AR28(PS_DDR_A14) ; port DDR4_SDRAM.DDR4_A14_WE_B  [project net DDR4_PS.DDR4_A14_WE_B]
DDR4_A15_CAS_B: IC18.AP30(PS_DDR_A15) ; port DDR4_SDRAM.DDR4_A15_CAS_B  [project net DDR4_PS.DDR4_A15_CAS_B]
DDR4_A16_RAS_B: IC18.AP28(PS_DDR_A16) ; port DDR4_SDRAM.DDR4_A16_RAS_B  [project net DDR4_PS.DDR4_A16_RAS_B]
DDR4_ACT_B: IC18.AL30(PS_DDR_ACT_N) ; port DDR4_SDRAM.DDR4_ACT_B  [project net DDR4_PS.DDR4_ACT_B]
DDR4_ALERT_B: IC18.AL32(PS_DDR_ALERT_N) ; port DDR4_SDRAM.DDR4_ALERT_B  [project net DDR4_PS.DDR4_ALERT_B]
DDR4_BA0: IC18.AN30(PS_DDR_BA0) ; port DDR4_SDRAM.DDR4_BA0  [project net DDR4_PS.DDR4_BA0]
DDR4_BA1: IC18.AM32(PS_DDR_BA1) ; port DDR4_SDRAM.DDR4_BA1  [project net DDR4_PS.DDR4_BA1]
DDR4_BG0: IC18.AN32(PS_DDR_BG0) ; port DDR4_SDRAM.DDR4_BG0  [project net DDR4_PS.DDR4_BG0]
DDR4_CK_N: IC18.AV30(PS_DDR_CK_N0) ; port DDR4_SDRAM.DDR4_CK_N  [project net DDR4_PS.DDR4_CK_N]
DDR4_CK_P: IC18.AU30(PS_DDR_CK0) ; port DDR4_SDRAM.DDR4_CK_P  [project net DDR4_PS.DDR4_CK_P]
DDR4_CKE: IC18.AW30(PS_DDR_CKE0) ; port DDR4_SDRAM.DDR4_CKE  [project net DDR4_PS.DDR4_CKE]
DDR4_CS_B: IC18.AW29(PS_DDR_CS_N0) ; port DDR4_SDRAM.DDR4_CS_B  [project net DDR4_PS.DDR4_CS_B]
DDR4_DM0: IC18.AU23(PS_DDR_DM0)
DDR4_DM1: IC18.AT27(PS_DDR_DM1)
DDR4_DM2: IC18.AL24(PS_DDR_DM2)
DDR4_DM3: IC18.AM27(PS_DDR_DM3)
DDR4_DM4: IC18.AV36(PS_DDR_DM4)
DDR4_DM5: IC18.AT35(PS_DDR_DM5)
DDR4_DM6: IC18.AM36(PS_DDR_DM6)
DDR4_DM7: IC18.AJ32(PS_DDR_DM7)
DDR4_DQ0: IC18.AW25(PS_DDR_DQ0)
DDR4_DQ1: IC18.AW24(PS_DDR_DQ1)
DDR4_DQ2: IC18.AV25(PS_DDR_DQ2)
DDR4_DQ3: IC18.AW23(PS_DDR_DQ3)
DDR4_DQ4: IC18.AV23(PS_DDR_DQ4)
DDR4_DQ5: IC18.AV22(PS_DDR_DQ5)
DDR4_DQ6: IC18.AR24(PS_DDR_DQ6)
DDR4_DQ7: IC18.AR23(PS_DDR_DQ7)
DDR4_DQ8: IC18.AT25(PS_DDR_DQ8)
DDR4_DQ9: IC18.AP26(PS_DDR_DQ9)
DDR4_DQ10: IC18.AU25(PS_DDR_DQ10)
DDR4_DQ11: IC18.AR27(PS_DDR_DQ11)
DDR4_DQ12: IC18.AU27(PS_DDR_DQ12)
DDR4_DQ13: IC18.AV26(PS_DDR_DQ13)
DDR4_DQ14: IC18.AV27(PS_DDR_DQ14)
DDR4_DQ15: IC18.AW26(PS_DDR_DQ15)
DDR4_DQ16: IC18.AP25(PS_DDR_DQ16)
DDR4_DQ17: IC18.AP24(PS_DDR_DQ17)
DDR4_DQ18: IC18.AP23(PS_DDR_DQ18)
DDR4_DQ19: IC18.AN25(PS_DDR_DQ19)
DDR4_DQ20: IC18.AM25(PS_DDR_DQ20)
DDR4_DQ21: IC18.AK24(PS_DDR_DQ21)
DDR4_DQ22: IC18.AN23(PS_DDR_DQ22)
DDR4_DQ23: IC18.AK23(PS_DDR_DQ23)
DDR4_DQ24: IC18.AK26(PS_DDR_DQ24)
DDR4_DQ25: IC18.AL25(PS_DDR_DQ25)
DDR4_DQ26: IC18.AK28(PS_DDR_DQ26)
DDR4_DQ27: IC18.AK27(PS_DDR_DQ27)
DDR4_DQ28: IC18.AN27(PS_DDR_DQ28)
DDR4_DQ29: IC18.AN26(PS_DDR_DQ29)
DDR4_DQ30: IC18.AN28(PS_DDR_DQ30)
DDR4_DQ31: IC18.AM28(PS_DDR_DQ31)
DDR4_DQ32: IC18.AU39(PS_DDR_DQ32)
DDR4_DQ33: IC18.AU38(PS_DDR_DQ33)
DDR4_DQ34: IC18.AU37(PS_DDR_DQ34)
DDR4_DQ35: IC18.AU35(PS_DDR_DQ35)
DDR4_DQ36: IC18.AV38(PS_DDR_DQ36)
DDR4_DQ37: IC18.AW36(PS_DDR_DQ37)
DDR4_DQ38: IC18.AV35(PS_DDR_DQ38)
DDR4_DQ39: IC18.AW35(PS_DDR_DQ39)
DDR4_DQ40: IC18.AU33(PS_DDR_DQ40)
DDR4_DQ41: IC18.AV33(PS_DDR_DQ41)
DDR4_DQ42: IC18.AW34(PS_DDR_DQ42)
DDR4_DQ43: IC18.AW33(PS_DDR_DQ43)
DDR4_DQ44: IC18.AR34(PS_DDR_DQ44)
DDR4_DQ45: IC18.AR33(PS_DDR_DQ45)
DDR4_DQ46: IC18.AP33(PS_DDR_DQ46)
DDR4_DQ47: IC18.AP34(PS_DDR_DQ47)
DDR4_DQ48: IC18.AL39(PS_DDR_DQ48)
DDR4_DQ49: IC18.AM38(PS_DDR_DQ49)
DDR4_DQ50: IC18.AM39(PS_DDR_DQ50)
DDR4_DQ51: IC18.AN38(PS_DDR_DQ51)
DDR4_DQ52: IC18.AM35(PS_DDR_DQ52)
DDR4_DQ53: IC18.AM34(PS_DDR_DQ53)
DDR4_DQ54: IC18.AN36(PS_DDR_DQ54)
DDR4_DQ55: IC18.AN35(PS_DDR_DQ55)
DDR4_DQ56: IC18.AK32(PS_DDR_DQ56)
DDR4_DQ57: IC18.AK31(PS_DDR_DQ57)
DDR4_DQ58: IC18.AJ31(PS_DDR_DQ58)
DDR4_DQ59: IC18.AJ30(PS_DDR_DQ59)
DDR4_DQ60: IC18.AH30(PS_DDR_DQ60)
DDR4_DQ61: IC18.AG32(PS_DDR_DQ61)
DDR4_DQ62: IC18.AF32(PS_DDR_DQ62)
DDR4_DQ63: IC18.AG30(PS_DDR_DQ63)
DDR4_DQS0_N: IC18.AU24(PS_DDR_DQS_N0) ; port DDR4_SDRAM.DDR4_DQS0_N  [project net DDR4_PS.DDR4_DQS0_N]
DDR4_DQS0_P: IC18.AT24(PS_DDR_DQS_P0) ; port DDR4_SDRAM.DDR4_DQS0_P  [project net DDR4_PS.DDR4_DQS0_P]
DDR4_DQS1_N: IC18.AT26(PS_DDR_DQS_N1) ; port DDR4_SDRAM.DDR4_DQS1_N  [project net DDR4_PS.DDR4_DQS1_N]
DDR4_DQS1_P: IC18.AR26(PS_DDR_DQS_P1) ; port DDR4_SDRAM.DDR4_DQS1_P  [project net DDR4_PS.DDR4_DQS1_P]
DDR4_DQS2_N: IC18.AM24(PS_DDR_DQS_N2) ; port DDR4_SDRAM.DDR4_DQS2_N  [project net DDR4_PS.DDR4_DQS2_N]
DDR4_DQS2_P: IC18.AM23(PS_DDR_DQS_P2) ; port DDR4_SDRAM.DDR4_DQS2_P  [project net DDR4_PS.DDR4_DQS2_P]
DDR4_DQS3_N: IC18.AL27(PS_DDR_DQS_N3) ; port DDR4_SDRAM.DDR4_DQS3_N  [project net DDR4_PS.DDR4_DQS3_N]
DDR4_DQS3_P: IC18.AL26(PS_DDR_DQS_P3) ; port DDR4_SDRAM.DDR4_DQS3_P  [project net DDR4_PS.DDR4_DQS3_P]
DDR4_DQS4_N: IC18.AW37(PS_DDR_DQS_N4) ; port DDR4_SDRAM.DDR4_DQS4_N  [project net DDR4_PS.DDR4_DQS4_N]
DDR4_DQS4_P: IC18.AV37(PS_DDR_DQS_P4) ; port DDR4_SDRAM.DDR4_DQS4_P  [project net DDR4_PS.DDR4_DQS4_P]
DDR4_DQS5_N: IC18.AU34(PS_DDR_DQS_N5) ; port DDR4_SDRAM.DDR4_DQS5_N  [project net DDR4_PS.DDR4_DQS5_N]
DDR4_DQS5_P: IC18.AT34(PS_DDR_DQS_P5) ; port DDR4_SDRAM.DDR4_DQS5_P  [project net DDR4_PS.DDR4_DQS5_P]
DDR4_DQS6_N: IC18.AN37(PS_DDR_DQS_N6) ; port DDR4_SDRAM.DDR4_DQS6_N  [project net DDR4_PS.DDR4_DQS6_N]
DDR4_DQS6_P: IC18.AM37(PS_DDR_DQS_P6) ; port DDR4_SDRAM.DDR4_DQS6_P  [project net DDR4_PS.DDR4_DQS6_P]
DDR4_DQS7_N: IC18.AH32(PS_DDR_DQS_N7) ; port DDR4_SDRAM.DDR4_DQS7_N  [project net DDR4_PS.DDR4_DQS7_N]
DDR4_DQS7_P: IC18.AH31(PS_DDR_DQS_P7) ; port DDR4_SDRAM.DDR4_DQS7_P  [project net DDR4_PS.DDR4_DQS7_P]
DDR4_ODT: IC18.AV32(PS_DDR_ODT0) ; port DDR4_SDRAM.DDR4_ODT  [project net DDR4_PS.DDR4_ODT]
DDR4_PAR: IC18.AN31(PS_DDR_PARITY) ; port DDR4_SDRAM.DDR4_PAR  [project net DDR4_PS.DDR4_PAR]
DDR4_RESET_B: IC18.AM33(PS_DDR_RAM_RST_N) ; port DDR4_SDRAM.DDR4_RESET_B  [project net DDR4_PS.DDR4_RESET_B]
NetIC18_AN33: IC18.AN33(PS_DDR_ZQ) R582.1

Not connected (* = marked no-connect by the designer): IC18 AK29(PS_DDR_A17) AL31(PS_DDR_BG1) AP31(PS_DDR_ODT1) AP35(PS_DDR_DQ67) AP36(PS_DDR_DQ70) AP38(PS_DDR_DQ69) AP39(PS_DDR_DQ71) AR29(PS_DDR_CK1) AR31(PS_DDR_CS_N1) AR32(PS_DDR_CKE1) AR36(PS_DDR_DQ65) AR37(PS_DDR_DQS_P8) AR38(PS_DDR_DM8) AR39(PS_DDR_DQ68) AT29(PS_DDR_CK_N1) AT36(PS_DDR_DQ64) AT37(PS_DDR_DQS_N8) AT39(PS_DDR_DQ66)

### Buses and harness runs
bus DDR4_A[13..0]
bus DDR4_DM[7..0]
bus DDR4_DQ[63..0]

### Layout directives
differential pair: DDR4_PS.DDR4_CK_N, DDR4_PS.DDR4_CK_P, DDR4_PS.DDR4_DQS0_N, DDR4_PS.DDR4_DQS0_P, DDR4_PS.DDR4_DQS1_N, DDR4_PS.DDR4_DQS1_P, DDR4_PS.DDR4_DQS2_N, DDR4_PS.DDR4_DQS2_P, DDR4_PS.DDR4_DQS3_N, DDR4_PS.DDR4_DQS3_P, DDR4_PS.DDR4_DQS4_N, DDR4_PS.DDR4_DQS4_P, DDR4_PS.DDR4_DQS5_N, DDR4_PS.DDR4_DQS5_P, DDR4_PS.DDR4_DQS6_N, DDR4_PS.DDR4_DQS6_P, DDR4_PS.DDR4_DQS7_N, DDR4_PS.DDR4_DQS7_P

### Notes on the sheet
- Project/Equipment
- Document
- Designer
- Drawn by
- Check.by
- Copyright WUT ISE 2021
  This documentation describes Open Hardware and is licensed under CERN OHL v.1.1. You may redistribute and modify this documentaction under the terms of the CERN OHL v1.1.
  (http://ohwr.org/CERNOHL). This documentation is dristributed WITHOUT ANY EXPRESS OR IMPLIED WARRANTY, INCLUDING OF MERCHANTABLITY, SATISFACTORY QUALITY AND FITNESS FOR A PARTICULAR PURPOSE. Please see the CERN OHL v.1.1 for applicable conditions
- File
- Last Mod.
- Print Date
- Sheet
- Size
- A3
- of
- Rev
- Contact:
- (in symbol R0402_240R_1%_0.0625W_100PPM) 1%
- (in symbol XCZU27DR-1FSVG1517E, part X) BANK 504

### Library data of the parts
IC18 = XCZU27DR-1FSVG1517E: as IC18 on sheet SoC_FPGA_HD_84_87; Part Number: XCZU27DR-1FSVG1517E; Component Kind: Standard; Component Type: Standard; Device: XCZU27DR-1FSVG1517E; PackageDescription: BGA, 1.00mm Pitch, Square; 1517 Pin, 39 Columns X 39 Rows, 40.00mm X 40.00mm X 4.01mm H; Part Description: Zynq UltraScale+ RFSoC, Quad-Core ARM® Cortex™-A53 MPCore™ up to 1.5GHz, 214 PS I/O, 299 HP I/O, 48 HD I/O, 1517-Pin BGA; Manufacturer Part Number: XCZU27DR-1FSVG1517E; Pin Count: 1517; Case: BGA1517; Mounted: Yes; Socket: No; SMD: Yes; Sense: No; ComponentHeight: 4.01mm; HelpURL: \\cern.ch\dfs\Applications\Altium\Datasheets\XCZU27DR-1FSVG1517E.pdf; ComponentLink1URL: \\cern.ch\dfs\Applications\Altium\Datasheets\XCZU27DR-1FSVG1517E_Package-Pinout.pdf; ComponentLink1Description: Package/Pinout; ComponentLink2URL: \\cern.ch\dfs\Applications\Altium\Datasheets\XCZU27DR-1FSVG1517E_Pinout.pdf; ComponentLink2Description: Pinout; Author: CERN DEM MR; CreateDate: 02/05/2018; LatestRevisionDate: 02/05/2018
R582 = R0402_240R_1%_0.0625W_100PPM: Resistor - 1%; Manufacturer: GENERIC; Part Description: General Purpose Thick Film Chip Resistor; Manufacturer1 Part Number: 232270672401L; TC: ±100ppm/°C; PressFit: No; Manufacturer Part Number: R0402_240R_1%_0.0625W_100PPM; Part Number: R0402_240R_1%_0.0625W_100PPM; Tolerance: ±1%; Value: 240; Component Kind: Standard; Component Type: Standard; Pin Count: 2; Status: Not Recommended; Power: 0.0625W; Case: 0402; Mounted: Yes; Sense: No; Socket: No; SMD: Yes; Manufacturer1 Example: YAGEO PHYCOMP; Manufacturer1 ComponentHeight: 0.4mm; HelpURL: \\cern.ch\dfs\Applications\Altium\Datasheets\R0402_Phycomp_RC0402.pdf; Author: CERN DEM JLC; CreateDate: 03/12/2007; LatestRevisionDate: 17/10/2012

## Sheet SoC_PS_505_GTR.SchDoc: RFSoC AMC
size 420 x 297 mm; CompanyName: WUT; DrawnBy: T. Przywozki; Organization: WUT ISE; Address1: Warsaw University of Technology; Address2: Nowowiejska 15/19 00-665 Warsaw; Address3: Tomasz.Przywozki@pw.edu.pl; DocumentNumber: 11; Revision: 1; SheetNumber: 11; SheetTotal: 45; Project: RFSoC AMC; ModifiedBy: T. Przywozki; CreateDate: -; CheckedDate: -; DivGrp: ISE; Designer: T. Przywozki; ModifiedDate: -; ProjectName: ADC/DAC MEZZANINE
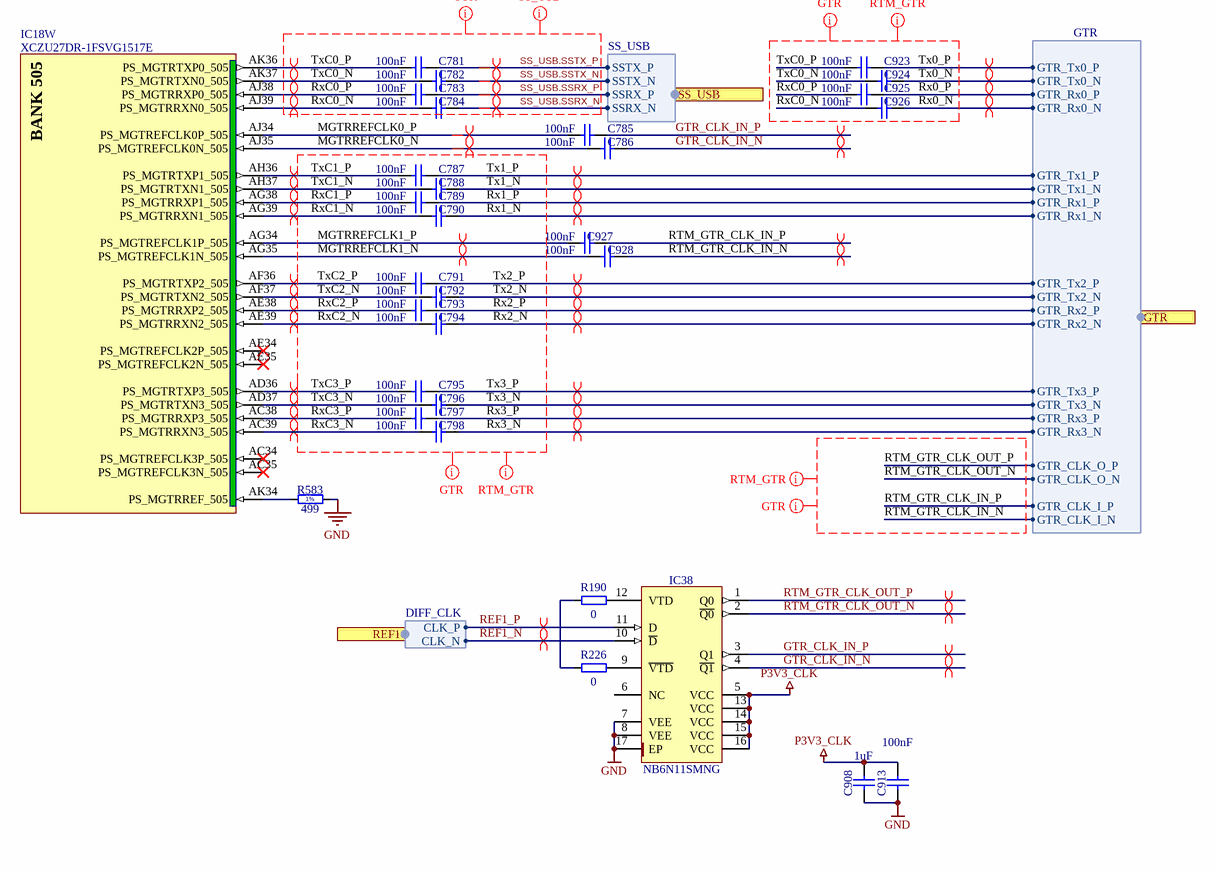
[diagram p34: SoC_PS_505_GTR.SchDoc]

### Parts
C781  100nF  [CAPC0603X33N]
C782  100nF  [CAPC0603X33N]
C783  100nF  [CAPC0603X33N]
C784  100nF  [CAPC0603X33N]
C785  100nF  [CAPC0603X33N]
C786  100nF  [CAPC0603X33N]
C787  100nF  [CAPC0603X33N]
C788  100nF  [CAPC0603X33N]
C789  100nF  [CAPC0603X33N]
C790  100nF  [CAPC0603X33N]
C791  100nF  [CAPC0603X33N]
C792  100nF  [CAPC0603X33N]
C793  100nF  [CAPC0603X33N]
C794  100nF  [CAPC0603X33N]
C795  100nF  [CAPC0603X33N]
C796  100nF  [CAPC0603X33N]
C797  100nF  [CAPC0603X33N]
C798  100nF  [CAPC0603X33N]
C908  1uF  [CAPC1005X55N]
C913  100nF  [CAPC0603X33N]
C923  100nF  [CAPC0603X33N]
C924  100nF  [CAPC0603X33N]
C925  100nF  [CAPC0603X33N]
C926  100nF  [CAPC0603X33N]
C927  100nF  [CAPC0603X33N]
C928  100nF  [CAPC0603X33N]
IC18  XCZU27DR-1FSVG1517E  [XILINX_FSVG1517 (XCZU27DR)]  (part W of 31)
IC38  NB6N11SMNG  [QFN50P300X300X100-17N-S185]
R190  0  [RESC1005X40N]
R226  0  [RESC1005X40N]
R583  499  [RESC1005X40N]

### Ports
GTR (harness GTR), REF1 (in, harness DIFF_CLK), SS_USB (harness SS_USB)

### Harnesses
DIFF_CLK: CLK_P, CLK_N
SS_USB: SSRX_P, SSTX_N, SSTX_P, SSRX_N
GTR: GTR_Tx0_P, GTR_Tx0_N, GTR_Rx0_P, GTR_Rx0_N, GTR_Rx1_P, GTR_Rx1_N, GTR_Tx1_P, GTR_Tx1_N, GTR_Rx2_P, GTR_Rx2_N, GTR_Tx2_P, GTR_Tx2_N, GTR_Rx3_P, GTR_Rx3_N, GTR_Tx3_P, GTR_Tx3_N, GTR_CLK_O_P, GTR_CLK_O_N, GTR_CLK_I_P, GTR_CLK_I_N

### Nets
GND: C908.2 C913.1 IC38.7(VEE) IC38.8(VEE) IC38.17(EP) R583.2
P3V3_CLK: C908.1 C913.2 IC38.5(VCC) IC38.13(VCC) IC38.14(VCC) IC38.15(VCC) IC38.16(VCC)  [project net AMS_CLK_VCC3V3]
GTR_CLK_IN_N: C786.2 IC38.4(~{Q1})
GTR_CLK_IN_P: C785.2 IC38.3(Q1)
MGTRREFCLK0_N: C786.1 IC18.AJ35(PS_MGTREFCLK0N_505)
MGTRREFCLK0_P: C785.1 IC18.AJ34(PS_MGTREFCLK0P_505)
MGTRREFCLK1_N: C928.1 IC18.AG35(PS_MGTREFCLK1N_505)
MGTRREFCLK1_P: C927.1 IC18.AG34(PS_MGTREFCLK1P_505)
REF1_N: IC38.10(~{D}) ; port REF1.CLK_N  [project net GTR_REF_N]
REF1_P: IC38.11(D) ; port REF1.CLK_P  [project net GTR_REF_P]
RTM_GTR_CLK_IN_N: C928.2 ; port GTR.GTR_CLK_I_N  [project net GTP0-3_CLK_IN_N]
RTM_GTR_CLK_IN_P: C927.2 ; port GTR.GTR_CLK_I_P  [project net GTP0-3_CLK_IN_P]
RTM_GTR_CLK_OUT_N: IC38.2(~{Q0}) ; port GTR.GTR_CLK_O_N  [project net GTP0-3_CLK_OUT_N]
RTM_GTR_CLK_OUT_P: IC38.1(Q0) ; port GTR.GTR_CLK_O_P  [project net GTP0-3_CLK_OUT_P]
Rx0_N: C926.2 ; port GTR.GTR_Rx0_N  [project net GTP0RX_N]
Rx0_P: C925.2 ; port GTR.GTR_Rx0_P  [project net GTP0RX_P]
Rx1_N: C790.2 ; port GTR.GTR_Rx1_N  [project net GTP1RX_N]
Rx1_P: C789.2 ; port GTR.GTR_Rx1_P  [project net GTP1RX_P]
Rx2_N: C794.2 ; port GTR.GTR_Rx2_N  [project net GTP2RX_N]
Rx2_P: C793.2 ; port GTR.GTR_Rx2_P  [project net GTP2RX_P]
Rx3_N: C798.2 ; port GTR.GTR_Rx3_N  [project net GTP3RX_N]
Rx3_P: C797.2 ; port GTR.GTR_Rx3_P  [project net GTP3RX_P]
RxC0_N: C784.1 C926.1 IC18.AJ39(PS_MGTRRXN0_505)
RxC0_P: C783.1 C925.1 IC18.AJ38(PS_MGTRRXP0_505)
RxC1_N: C790.1 IC18.AG39(PS_MGTRRXN1_505)
RxC1_P: C789.1 IC18.AG38(PS_MGTRRXP1_505)
RxC2_N: C794.1 IC18.AE39(PS_MGTRRXN2_505)
RxC2_P: C793.1 IC18.AE38(PS_MGTRRXP2_505)
RxC3_N: C798.1 IC18.AC39(PS_MGTRRXN3_505)
RxC3_P: C797.1 IC18.AC38(PS_MGTRRXP3_505)
SS_USB.SSRX_N: C784.2 ; port SS_USB.SSRX_N
SS_USB.SSRX_P: C783.2 ; port SS_USB.SSRX_P
SS_USB.SSTX_N: C782.2 ; port SS_USB.SSTX_N
SS_USB.SSTX_P: C781.2 ; port SS_USB.SSTX_P
Tx0_N: C924.2 ; port GTR.GTR_Tx0_N  [project net GTP0TX_N]
Tx0_P: C923.2 ; port GTR.GTR_Tx0_P  [project net GTP0TX_P]
Tx1_N: C788.2 ; port GTR.GTR_Tx1_N  [project net GTP1TX_N]
Tx1_P: C787.2 ; port GTR.GTR_Tx1_P  [project net GTP1TX_P]
Tx2_N: C792.2 ; port GTR.GTR_Tx2_N  [project net GTP2TX_N]
Tx2_P: C791.2 ; port GTR.GTR_Tx2_P  [project net GTP2TX_P]
Tx3_N: C796.2 ; port GTR.GTR_Tx3_N  [project net GTP3TX_N]
Tx3_P: C795.2 ; port GTR.GTR_Tx3_P  [project net GTP3TX_P]
TxC0_N: C782.1 C924.1 IC18.AK37(PS_MGTRTXN0_505)
TxC0_P: C781.1 C923.1 IC18.AK36(PS_MGTRTXP0_505)
TxC1_N: C788.1 IC18.AH37(PS_MGTRTXN1_505)
TxC1_P: C787.1 IC18.AH36(PS_MGTRTXP1_505)
TxC2_N: C792.1 IC18.AF37(PS_MGTRTXN2_505)
TxC2_P: C791.1 IC18.AF36(PS_MGTRTXP2_505)
TxC3_N: C796.1 IC18.AD37(PS_MGTRTXN3_505)
TxC3_P: C795.1 IC18.AD36(PS_MGTRTXP3_505)
NetIC18_AK34: IC18.AK34(PS_MGTRREF_505) R583.1
NetIC38_9: IC38.9(~{VTD}) R226.2
NetIC38_12: IC38.12(VTD) R190.2
NetR190_1: R190.1 R226.1

Not connected (* = marked no-connect by the designer): IC18 AC34(PS_MGTREFCLK3P_505)* AC35(PS_MGTREFCLK3N_505)* AE34(PS_MGTREFCLK2P_505)* AE35(PS_MGTREFCLK2N_505)*; IC38 6(NC)

### Layout directives
differential pair: GTP0-3_CLK_IN_N, GTP0-3_CLK_IN_P, GTP0-3_CLK_OUT_N, GTP0-3_CLK_OUT_P, GTP0RX_N, GTP0RX_P, GTP0TX_N, GTP0TX_P, GTP1RX_N, GTP1RX_P, GTP1TX_N, GTP1TX_P, GTP2RX_N, GTP2RX_P, GTP2TX_N, GTP2TX_P, GTP3RX_N, GTP3RX_P, GTP3TX_N, GTP3TX_P, GTR_CLK_IN_N, GTR_CLK_IN_P, GTR_REF_N, GTR_REF_P, MGTRREFCLK0_N, MGTRREFCLK0_P, MGTRREFCLK1_N, MGTRREFCLK1_P, RxC0_N, RxC0_P, RxC1_N, RxC1_P, RxC2_N, RxC2_P, RxC3_N, RxC3_P, TxC0_N, TxC0_P, TxC1_N, TxC1_P, TxC2_N, TxC2_P, TxC3_N, TxC3_P
net class RTM_GTR: MGTRREFCLK1_N, MGTRREFCLK1_P, RTM_GTR_CLK_IN_N, RTM_GTR_CLK_IN_P, RTM_GTR_CLK_OUT_N, RTM_GTR_CLK_OUT_P, Rx0_N, Rx0_P, Rx1_N, Rx1_P, Rx2_N, Rx2_P, Rx3_N, Rx3_P, RxC0_N, RxC0_P, RxC1_N, RxC1_P, RxC2_N, RxC2_P, RxC3_N, RxC3_P, Tx0_N, Tx0_P, Tx1_N, Tx1_P, Tx2_N, Tx2_P, Tx3_N, Tx3_P, TxC0_N, TxC0_P, TxC1_N, TxC1_P, TxC2_N, TxC2_P, TxC3_N, TxC3_P
net class GTR; net class GT: MGTRREFCLK1_N, MGTRREFCLK1_P, RTM_GTR_CLK_IN_N, RTM_GTR_CLK_IN_P, RTM_GTR_CLK_OUT_N, RTM_GTR_CLK_OUT_P, Rx0_N, Rx0_P, Rx1_N, Rx1_P, Rx2_N, Rx2_P, Rx3_N, Rx3_P, RxC0_N, RxC0_P, RxC1_N, RxC1_P, RxC2_N, RxC2_P, RxC3_N, RxC3_P, SS_USB.SSRX_N, SS_USB.SSRX_P, SS_USB.SSTX_N, SS_USB.SSTX_P, Tx0_N, Tx0_P, Tx1_N, Tx1_P, Tx2_N, Tx2_P, Tx3_N, Tx3_P, TxC0_N, TxC0_P, TxC1_N, TxC1_P, TxC2_N, TxC2_P, TxC3_N, TxC3_P
net class SS_USB: RxC0_N, RxC0_P, SS_USB.SSRX_N, SS_USB.SSRX_P, SS_USB.SSTX_N, SS_USB.SSTX_P, TxC0_N, TxC0_P
differential pair; differential pair class 90ohm: SS_USB.SSRX_N, SS_USB.SSRX_P, SS_USB.SSTX_N, SS_USB.SSTX_P

### Notes on the sheet
- Project/Equipment
- Document
- Designer
- Drawn by
- Check.by
- Copyright WUT ISE 2021
  This documentation describes Open Hardware and is licensed under CERN OHL v.1.1. You may redistribute and modify this documentaction under the terms of the CERN OHL v1.1.
  (http://ohwr.org/CERNOHL). This documentation is dristributed WITHOUT ANY EXPRESS OR IMPLIED WARRANTY, INCLUDING OF MERCHANTABLITY, SATISFACTORY QUALITY AND FITNESS FOR A PARTICULAR PURPOSE. Please see the CERN OHL v.1.1 for applicable conditions
- File
- Last Mod.
- Print Date
- Sheet
- Size
- A3
- of
- Rev
- Contact:
- (in symbol R0402_499R_1%_0.1W_100PPM) 1%
- (in symbol XCZU27DR-1FSVG1517E, part W) BANK 505

### Library data of the parts
C781-C798 C923-C928 = CC0201_100NF_6.3V_10%_X5R: Non-polarised capacitor; Part Description: SMD Multilayer Chip Ceramic Capacitor; Manufacturer: GENERIC; Manufacturer1 Part Number: 02016D104KAT2A; Voltage: 6.3V; TC: X5R; Tolerance: ±10%; Part Number: CC0201_100NF_6.3V_10%_X5R; Component Kind: Standard; Component Type: Standard; Pin Count: 2; Value: 100nF; Status: Not Recommended; Manufacturer Part Number: CC0201_100NF_6.3V_10%_X5R; Case: 0201; Mounted: Yes; Socket: No; SMD: Yes; Sense: No; Manufacturer1 Example: AVX; Manufacturer1 ComponentHeight: 0.33mm; HelpURL: \\cern.ch\dfs\Applications\Altium\Datasheets\CC0201_X5R_AVX.pdf; Author: CERN DEM JLC; CreateDate: 03/12/2007; LatestRevisionDate: 03/12/2007
C908 = CC0402_1UF_16V_10%_X5R: Non-polarised capacitor; Manufacturer: GENERIC; Part Description: SMD Multilayer Chip Ceramic Capacitor; Manufacturer1 Part Number: C1005X5R1C105KT; Tolerance: ±10%; Voltage: 16V; TC: X5R; Manufacturer Part Number: CC0402_1UF_16V_10%_X5R; Part Number: CC0402_1UF_16V_10%_X5R; Value: 1uF; Component Kind: Standard; Component Type: Standard; Pin Count: 2; Status: Preferred; Case: 0402; Mounted: Yes; Socket: No; SMD: Yes; Sense: No; Manufacturer1 Example: TDK; Manufacturer1 ComponentHeight: 0.55mm; HelpURL: \\cern.ch\dfs\Applications\Altium\Datasheets\CC0402_X5R_TDK_C.pdf; Author: CERN DEM JLC; CreateDate: 25.10.2012; LatestRevisionDate: 25.10.2012
C913 = CC0201_100NF_6.3V_10%_X5R: Non-polarised capacitor; Manufacturer: GENERIC; Part Description: SMD Multilayer Chip Ceramic Capacitor; Manufacturer1 Part Number: 02016D104KAT2A; Tolerance: ±10%; Voltage: 6.3V; TC: X5R; Manufacturer Part Number: CC0201_100NF_6.3V_10%_X5R; Part Number: CC0201_100NF_6.3V_10%_X5R; Value: 100nF; Component Kind: Standard; Component Type: Standard; Pin Count: 2; Status: Not Recommended; Case: 0201; Mounted: Yes; Socket: No; SMD: Yes; Sense: No; Manufacturer1 Example: AVX; Manufacturer1 ComponentHeight: 0.33mm; HelpURL: \\cern.ch\dfs\Applications\Altium\Datasheets\CC0201_X5R_AVX.pdf; Author: CERN DEM JLC; CreateDate: 03.12.2007; LatestRevisionDate: 03.12.2007
IC18 = XCZU27DR-1FSVG1517E: as IC18 on sheet SoC_FPGA_HD_84_87; Part Number: XCZU27DR-1FSVG1517E; Component Kind: Standard; Component Type: Standard; Device: XCZU27DR-1FSVG1517E; PackageDescription: BGA, 1.00mm Pitch, Square; 1517 Pin, 39 Columns X 39 Rows, 40.00mm X 40.00mm X 4.01mm H; Part Description: Zynq UltraScale+ RFSoC, Quad-Core ARM® Cortex™-A53 MPCore™ up to 1.5GHz, 214 PS I/O, 299 HP I/O, 48 HD I/O, 1517-Pin BGA; Manufacturer Part Number: XCZU27DR-1FSVG1517E; Pin Count: 1517; Case: BGA1517; Mounted: Yes; Socket: No; SMD: Yes; Sense: No; ComponentHeight: 4.01mm; HelpURL: \\cern.ch\dfs\Applications\Altium\Datasheets\XCZU27DR-1FSVG1517E.pdf; ComponentLink1URL: \\cern.ch\dfs\Applications\Altium\Datasheets\XCZU27DR-1FSVG1517E_Package-Pinout.pdf; ComponentLink1Description: Package/Pinout; ComponentLink2URL: \\cern.ch\dfs\Applications\Altium\Datasheets\XCZU27DR-1FSVG1517E_Pinout.pdf; ComponentLink2Description: Pinout; Author: CERN DEM MR; CreateDate: 02/05/2018; LatestRevisionDate: 02/05/2018
IC38 = NB6N11SMNG: 3.3V 1:2 AnyLevel Input to LVDS Fanout Buffer / Translator; Manufacturer: ON SEMICONDUCTOR; PressFit: No; Bonding: No; Part Number: NB6N11SMNG; Component Kind: Standard; Component Type: Standard; Device: NB6N11SMNG; PackageDescription: QFN, 0.50mm Pitch, Square; 16 Pin, 3.00mm L X 3.00mm W X 1.00mm H body (w/Thermal Tab 1.85 X 1.85mm), IPC Medium Density; Part Description: 3.3V 1:2 AnyLevel Input to LVDS Fanout Buffer / Translator; Manufacturer Part Number: NB6N11SMNG; Pin Count: 17; Case: QFN16; Mounted: Yes; Socket: No; SMD: Yes; Sense: No; ComponentHeight: 1mm; Author: CERN DEM JLC; HelpURL: \\cern.ch\dfs\Applications\Altium\Datasheets\NB6N11SMNG.pdf; CreateDate: 14.05.2013; LatestRevisionDate: 14.05.2013
R190 R226 = R0402_0R_JUMPER: Resistor; Part Description: 1A (0.05R Max DC Resistance) Zero Ohm Jumper; Manufacturer: GENERIC; Manufacturer1 Part Number: 232270591001L; PressFit: No; Part Number: R0402_0R_JUMPER; Component Kind: Standard; Component Type: Standard; Pin Count: 2; Value: 0; Status: Not Recommended; Manufacturer Part Number: R0402_0R_JUMPER; Case: 0402; Mounted: Yes; Sense: No; Socket: No; SMD: Yes; Manufacturer1 Example: YAGEO PHYCOMP; Manufacturer1 ComponentHeight: 0.4mm; HelpURL: \\cern.ch\dfs\Applications\Altium\Datasheets\R0402_Phycomp_RC0402.pdf; Author: CERN DEM JLC; CreateDate: 03.12.2007; LatestRevisionDate: 17.10.2012
R583 = R0402_499R_1%_0.1W_100PPM: Resistor - 1%; Part Description: General Purpose Thick Film Chip Resistor; Manufacturer: GENERIC; Manufacturer1 Part Number: ERJ2RKF4990X; Power: 0.1W; TC: ±100ppm/°C; Voltage: 50V; PressFit: No; Part Number: R0402_499R_1%_0.1W_100PPM; Component Kind: Standard; Component Type: Standard; Pin Count: 2; Value: 499; Status: Not Recommended; Tolerance: ±1%; Manufacturer Part Number: R0402_499R_1%_0.1W_100PPM; Case: 0402; Mounted: Yes; Sense: No; Socket: No; SMD: Yes; Manufacturer1 Example: PANASONIC; Manufacturer1 ComponentHeight: 0.4mm; HelpURL: \\cern.ch\dfs\Applications\Altium\Datasheets\R0402_PANASONIC_ERJ2RK.pdf; Author: CERN DEM MR; CreateDate: 22.11.2016; LatestRevisionDate: 22.11.2016